# Altium project SAM_E54_Xplained_Pro.PrjPCB (part 1 of 4)
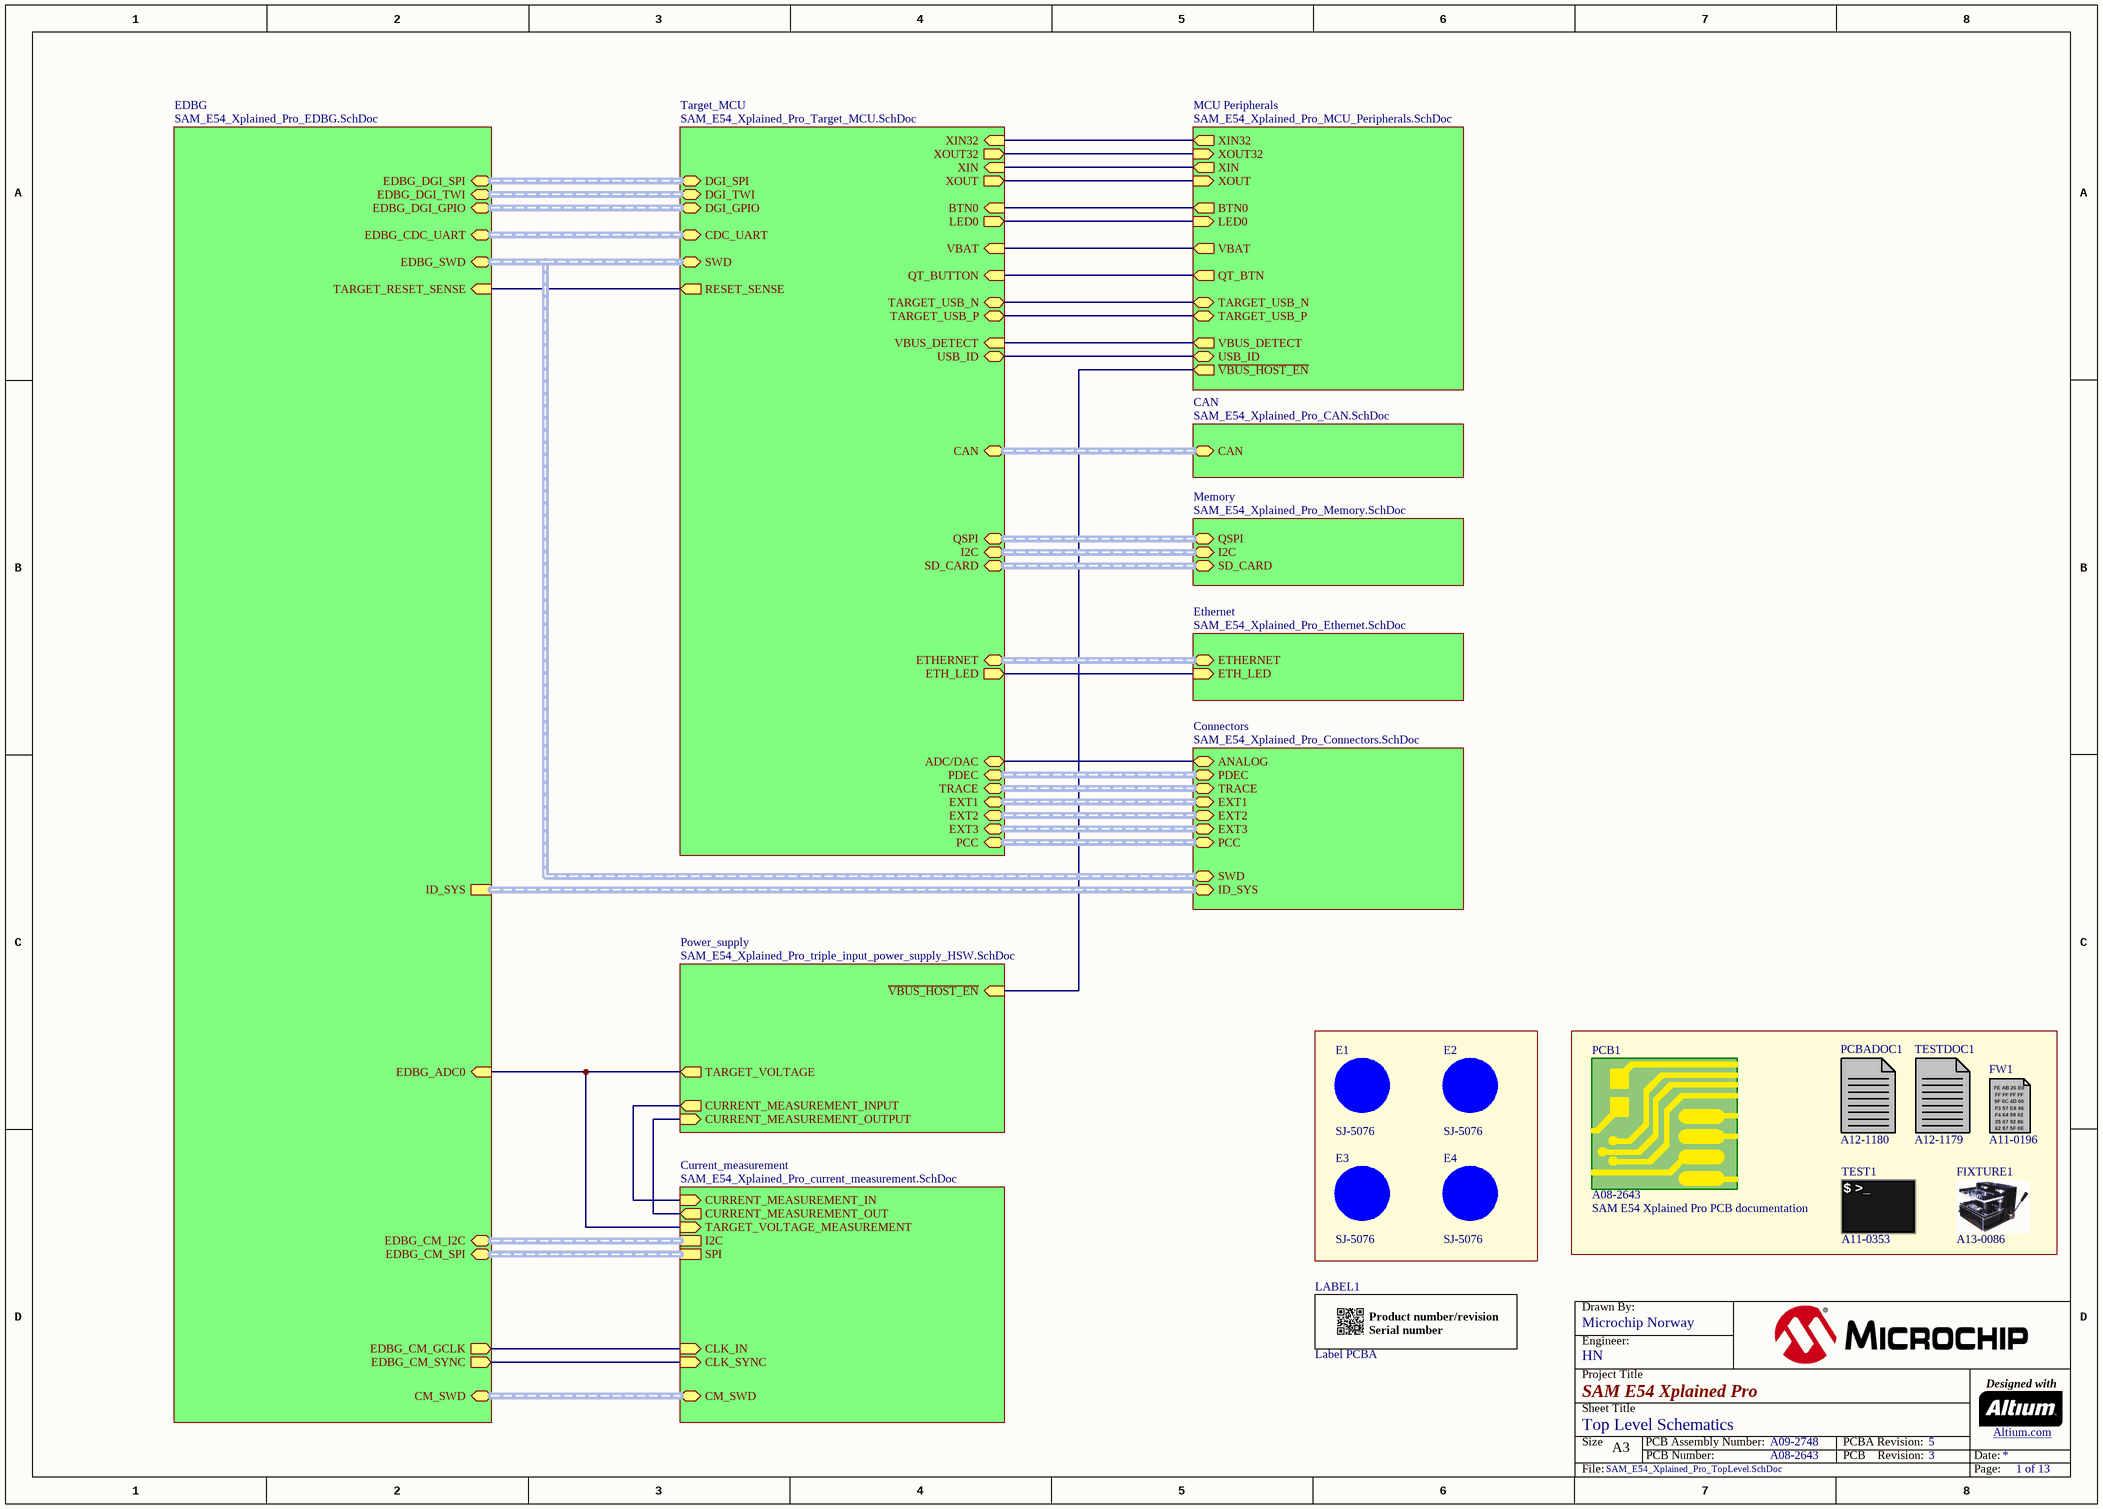
[diagram p0: SAM_E54_Xplained_Pro_TopLevel.SchDoc]
13 sheets, 307 parts. Net scope: hierarchical (ports join the sheet entries above them; power ports are global).
Board file: SAM_E54_Xplained_Pro.PcbDoc
Sheets:
  SAM_E54_Xplained_Pro_TopLevel.SchDoc
    Target_MCU = SAM_E54_Xplained_Pro_Target_MCU.SchDoc
    EDBG = SAM_E54_Xplained_Pro_EDBG.SchDoc
    Connectors = SAM_E54_Xplained_Pro_Connectors.SchDoc
    Power_supply = SAM_E54_Xplained_Pro_triple_input_power_supply_HSW.SchDoc
    Current_measurement = SAM_E54_Xplained_Pro_current_measurement.SchDoc
      Calibration = SAM_E54_Xplained_Pro_current_measurement_calibration.SchDoc
      Control = SAM_E54_Xplained_Pro_current_measurement_control.SchDoc
      Frontend = SAM_E54_Xplained_Pro_current_measurement_frontend.SchDoc
    Ethernet = SAM_E54_Xplained_Pro_Ethernet.SchDoc
    CAN = SAM_E54_Xplained_Pro_CAN.SchDoc
    Memory = SAM_E54_Xplained_Pro_Memory.SchDoc
    MCU Peripherals = SAM_E54_Xplained_Pro_MCU_Peripherals.SchDoc

## Sheet SAM_E54_Xplained_Pro_TopLevel.SchDoc: Top Level Schematics
size A3; Organization: Microchip Norway; Address1: Vestre Rosten 79; Address2: N-7075 TILLER; Address3: NORWAY; DocumentNumber: A09-2748; Revision: 5; SheetNumber: 1; SheetTotal: 13; DrawnBy: Microchip Norway; Engineer: HN; PageSetup: Record=PageOptions|CenterHorizontal=True|CenterVertical=True|PrintScale=1.01|XCorrection=1.00|YCorrection=1.00|PrintKind=1|BorderSize=5000000|LeftOffset=0|BottomOffset=0|Orientation=2|PaperLength=1000|PaperWidth=1000|Scale=100|PaperSource=7|PrintQuality=-4|MediaType=1|DitherType=10|PaperKind=Letter|PrintScaleMode=1; PCBNumber: A08-2643; PCBRevision: 3; ProjectTitle: SAM E54 Xplained Pro; ProjectName: SAM E54 Xplained Pro

### Parts
E1  value SJ-5076  [AP8-00192]
E2  value SJ-5076  [AP8-00192]
E3  value SJ-5076  [AP8-00192]
E4  value SJ-5076  [AP8-00192]
FIXTURE1  AN: A13-0086  (mechanical)
FW1  AN: A11-0196  (mechanical)
LABEL1  value Label PCBA  [AP8-00317]  (hidden comment: *)
PCB1  value SAM E54 Xplained Pro PCB documentation  AN: A08-2643  (mechanical)
PCBADOC1  AN: A12-1180  (mechanical)
TEST1  AN: A11-0353  (mechanical)
TESTDOC1  AN: A12-1179  (mechanical)

### Sub-sheets
CAN = SAM_E54_Xplained_Pro_CAN.SchDoc: CAN (harness CAN)
Connectors = SAM_E54_Xplained_Pro_Connectors.SchDoc: EXT1 (harness EXT), EXT3 (harness EXT), SWD (harness SWD), ID_SYS (harness ID_SYS), EXT2 (harness EXT), TRACE (harness TRACE), PCC (harness PCC), PDEC (harness PDEC), ANALOG (bidir)
Current_measurement = SAM_E54_Xplained_Pro_current_measurement.SchDoc: I2C (harness I2C), SPI (harness SPI), CLK_IN (in), CLK_SYNC (in), CURRENT_MEASUREMENT_OUT (out), CURRENT_MEASUREMENT_IN (in), TARGET_VOLTAGE_MEASUREMENT (in), CM_SWD (harness SWD)
EDBG = SAM_E54_Xplained_Pro_EDBG.SchDoc: ID_SYS (harness ID_SYS), EDBG_CDC_UART (harness UART), EDBG_DGI_TWI (harness I2C), EDBG_DGI_SPI (harness SPI), TARGET_RESET_SENSE (in), EDBG_ADC0 (in), EDBG_CM_I2C (harness I2C), EDBG_CM_SPI (harness SPI), EDBG_CM_GCLK (out), EDBG_CM_SYNC (out), CM_SWD (harness SWD), EDBG_SWD (harness SWD), EDBG_DGI_GPIO (harness GPIO)
Ethernet = SAM_E54_Xplained_Pro_Ethernet.SchDoc: ETHERNET (harness ETHERNET), ETH_LED (in)
MCU Peripherals = SAM_E54_Xplained_Pro_MCU_Peripherals.SchDoc: VBUS_DETECT (out), XIN32 (out), XIN (out), XOUT32 (in), TARGET_USB_N (bidir), TARGET_USB_P (bidir), BTN0 (out), LED0 (in), XOUT (in), ~{VBUS_HOST_EN} (out), VBAT (out), USB_ID (bidir), QT_BTN (out)
Memory = SAM_E54_Xplained_Pro_Memory.SchDoc: QSPI (harness QSPI), I2C (harness I2C), SD_CARD (harness SD_CARD)
Power_supply = SAM_E54_Xplained_Pro_triple_input_power_supply_HSW.SchDoc: TARGET_VOLTAGE (out), CURRENT_MEASUREMENT_INPUT (out), CURRENT_MEASUREMENT_OUTPUT (in), ~{VBUS_HOST_EN} (in)
Target_MCU = SAM_E54_Xplained_Pro_Target_MCU.SchDoc: DGI_SPI (harness SPI), DGI_TWI (harness I2C), CDC_UART (harness UART), EXT3 (harness EXT), EXT1 (harness EXT), RESET_SENSE (out), SWD (harness SWD), EXT2 (harness EXT), CAN (harness CAN), QSPI (harness QSPI), I2C (harness I2C), SD_CARD (harness SD_CARD), ETHERNET (harness ETHERNET), VBUS_DETECT (in), XIN32 (in), XIN (in), XOUT32 (out), TARGET_USB_N (bidir), TARGET_USB_P (bidir), BTN0 (in), LED0 (out), XOUT (out), USB_ID (bidir), VBAT (in), TRACE (harness TRACE), PCC (harness PCC), ETH_LED (out), DGI_GPIO (harness GPIO), QT_BUTTON (in), PDEC (harness PDEC), ADC/DAC (bidir)

### Nets
CM_PA09_AIN17: sheet EDBG/EDBG_ADC0, sheet Power_supply/TARGET_VOLTAGE, sheet Current_measurement/TARGET_VOLTAGE_MEASUREMENT
CM_PA11_GCLK5: sheet EDBG/EDBG_CM_SYNC, sheet Current_measurement/CLK_SYNC
CM_PA14_GCLK0: sheet EDBG/EDBG_CM_GCLK, sheet Current_measurement/CLK_IN
PA00_XIN32: sheet Target_MCU/XIN32, sheet MCU Peripherals/XIN32
PA01_XOUT32: sheet Target_MCU/XOUT32, sheet MCU Peripherals/XOUT32
PA02_ADC0_AIN0_DAC0: sheet Target_MCU/ADC/DAC, sheet Connectors/ANALOG
PA16_PCC_D00_PTCXY10: sheet Target_MCU/QT_BUTTON, sheet MCU Peripherals/QT_BTN
PB03_SUPER_CAP: sheet Target_MCU/VBAT, sheet MCU Peripherals/VBAT
PB22_XIN1: sheet Target_MCU/XIN, sheet MCU Peripherals/XIN
PB23_XOUT1: sheet Target_MCU/XOUT, sheet MCU Peripherals/XOUT
PB31_USER_BTN_DGI3: sheet Target_MCU/BTN0, sheet MCU Peripherals/BTN0
PC00_USB_VBUS: sheet Target_MCU/VBUS_DETECT, sheet MCU Peripherals/VBUS_DETECT
PC15_ETH_LED: sheet Target_MCU/ETH_LED, sheet Ethernet/ETH_LED
PC18_PDEC2_DGI2_LED: sheet Target_MCU/LED0, sheet MCU Peripherals/LED0
PC19_USB_ID: sheet Target_MCU/USB_ID, sheet MCU Peripherals/USB_ID
TARGET_RESETN: sheet Target_MCU/RESET_SENSE, sheet EDBG/TARGET_RESET_SENSE
TARGET_USB_N: sheet Target_MCU/TARGET_USB_N, sheet MCU Peripherals/TARGET_USB_N
TARGET_USB_P: sheet Target_MCU/TARGET_USB_P, sheet MCU Peripherals/TARGET_USB_P
VCC_CM_IN_P3V3: sheet Power_supply/CURRENT_MEASUREMENT_INPUT, sheet Current_measurement/CURRENT_MEASUREMENT_IN
NetJ100_3: sheet Power_supply/CURRENT_MEASUREMENT_OUTPUT, sheet Current_measurement/CURRENT_MEASUREMENT_OUT
NetJ303_4: sheet Power_supply/~{VBUS_HOST_EN}, sheet MCU Peripherals/~{VBUS_HOST_EN}

Not connected (* = marked no-connect by the designer): E1 1(FIDUCIAL); E2 1(FIDUCIAL); E3 1(FIDUCIAL); E4 1(FIDUCIAL)

### Buses and harness runs
harness sheet CAN/CAN = sheet Target_MCU/CAN
harness sheet Connectors/EXT1 = sheet Target_MCU/EXT1
harness sheet Connectors/EXT2 = sheet Target_MCU/EXT2
harness sheet Connectors/EXT3 = sheet Target_MCU/EXT3
harness sheet Connectors/ID_SYS = sheet EDBG/ID_SYS
harness sheet Connectors/PCC = sheet Target_MCU/PCC
harness sheet Connectors/PDEC = sheet Target_MCU/PDEC
harness sheet Connectors/SWD = sheet EDBG/EDBG_SWD = sheet Target_MCU/SWD
harness sheet Connectors/TRACE = sheet Target_MCU/TRACE
harness sheet Current_measurement/CM_SWD = sheet EDBG/CM_SWD
harness sheet Current_measurement/I2C = sheet EDBG/EDBG_CM_I2C
harness sheet Current_measurement/SPI = sheet EDBG/EDBG_CM_SPI
harness sheet EDBG/EDBG_CDC_UART = sheet Target_MCU/CDC_UART
harness sheet EDBG/EDBG_DGI_GPIO = sheet Target_MCU/DGI_GPIO
harness sheet EDBG/EDBG_DGI_SPI = sheet Target_MCU/DGI_SPI
harness sheet EDBG/EDBG_DGI_TWI = sheet Target_MCU/DGI_TWI
harness sheet Ethernet/ETHERNET = sheet Target_MCU/ETHERNET
harness sheet Memory/I2C = sheet Target_MCU/I2C
harness sheet Memory/QSPI = sheet Target_MCU/QSPI
harness sheet Memory/SD_CARD = sheet Target_MCU/SD_CARD

### Notes on the sheet
- Drawn By:
- Project Title
- Engineer:
- Designed with
- Sheet Title
- Size
- A3
- PCB Number:
- PCB Assembly Number:
- PCBA Revision:
- PCB    Revision:
- Date:
- Altium.com <http://go.altium.com/MicrochipLandingPage_Evaluation.html>
- File:
- Page:
- (in symbol A09-0611) / Product number/revision / Serial number
- (in symbol A11-0196) FE AB 26 E0; FF FF FF FF; 9F 0C 4D 00; F3 57 E8 96; F4 64 98 02; 35 07 92 86; 62 87 5F 0E
- (in symbol A11-0353) $ >_

### Library data of the parts
E1-E4 = A08-0053: 2.8mm adhesive feet,diam 8.0mm; PartGroup: Mechanical devices,Mounting accessories; Manufacturer: 3M; AN: A08-0053; Height: 2,79999995231628; MPN: SJ-5076
FIXTURE1 = A13-0086: Xplained PRO MCU board Jupiter Test Fixture; PartGroup: Test Equipment,Test Fixtures; Manufacturer: ESCATEC; Value: Xplained PRO MCU board Jupiter Test Fixture; MPN: Xplained PRO MCU board Jupiter Test Fixture
FW1 = A11-0196: EDBG secured firmware; PartGroup: Software,Firmware,Tools; Manufacturer: ATMEL; Value: EDBG secured firmware
LABEL1 = A09-0611: PCBA identification label PP Top White Gloss; PartGroup: Mechanical devices,Packaging materials,Printed Labels; Manufacturer: ACT Logimark AS; MPN: 505462; AN: A09-0611
PCB1 = A08-2643: SAM E54 Xplained Pro PCB documentation; PartGroup: Mechanical devices,Printed circuit boards
PCBADOC1 = A12-1180: SAM E54 Xplained Pro PCBA documentation; PartGroup: Documentation,PCBA Documents,Atmel; Value: SAM E54 Xplained Pro PCBA documentation
TEST1 = A11-0353: SAM E54 Xplained Pro eggTest; PartGroup: Software,Test software,Tools; Value: SAM E54 Xplained Pro eggTest
TESTDOC1 = A12-1179: SAM E54 Xplained Pro Test Instructions; PartGroup: Documentation,Procedures,Test Instructions; Value: SAM E54 Xplained Pro Test Instructions

## Sheet SAM_E54_Xplained_Pro_Target_MCU.SchDoc: Target MCU
size A3; Organization: Microchip Norway; Address1: Vestre Rosten 79; Address2: N-7075 TILLER; Address3: NORWAY; DocumentNumber: A09-2748; Revision: 5; SheetNumber: 3; SheetTotal: 13; DrawnBy: Microchip Norway; Engineer: HN; PageSetup: Record=PageOptions|CenterHorizontal=True|CenterVertical=True|PrintScale=1.01|XCorrection=1.00|YCorrection=1.00|PrintKind=1|BorderSize=5000000|LeftOffset=0|BottomOffset=0|Orientation=2|PaperLength=1000|PaperWidth=1000|Scale=100|PaperSource=7|PrintQuality=-4|MediaType=1|DitherType=10|PaperKind=A3 (297 x 420 mm)|PrintScaleMode=1; ProjectTitle: SAM E54 Xplained Pro; PCBNumber: A08-2643; PCBRevision: 3; ProjectName: SAM E54 Xplained Pro
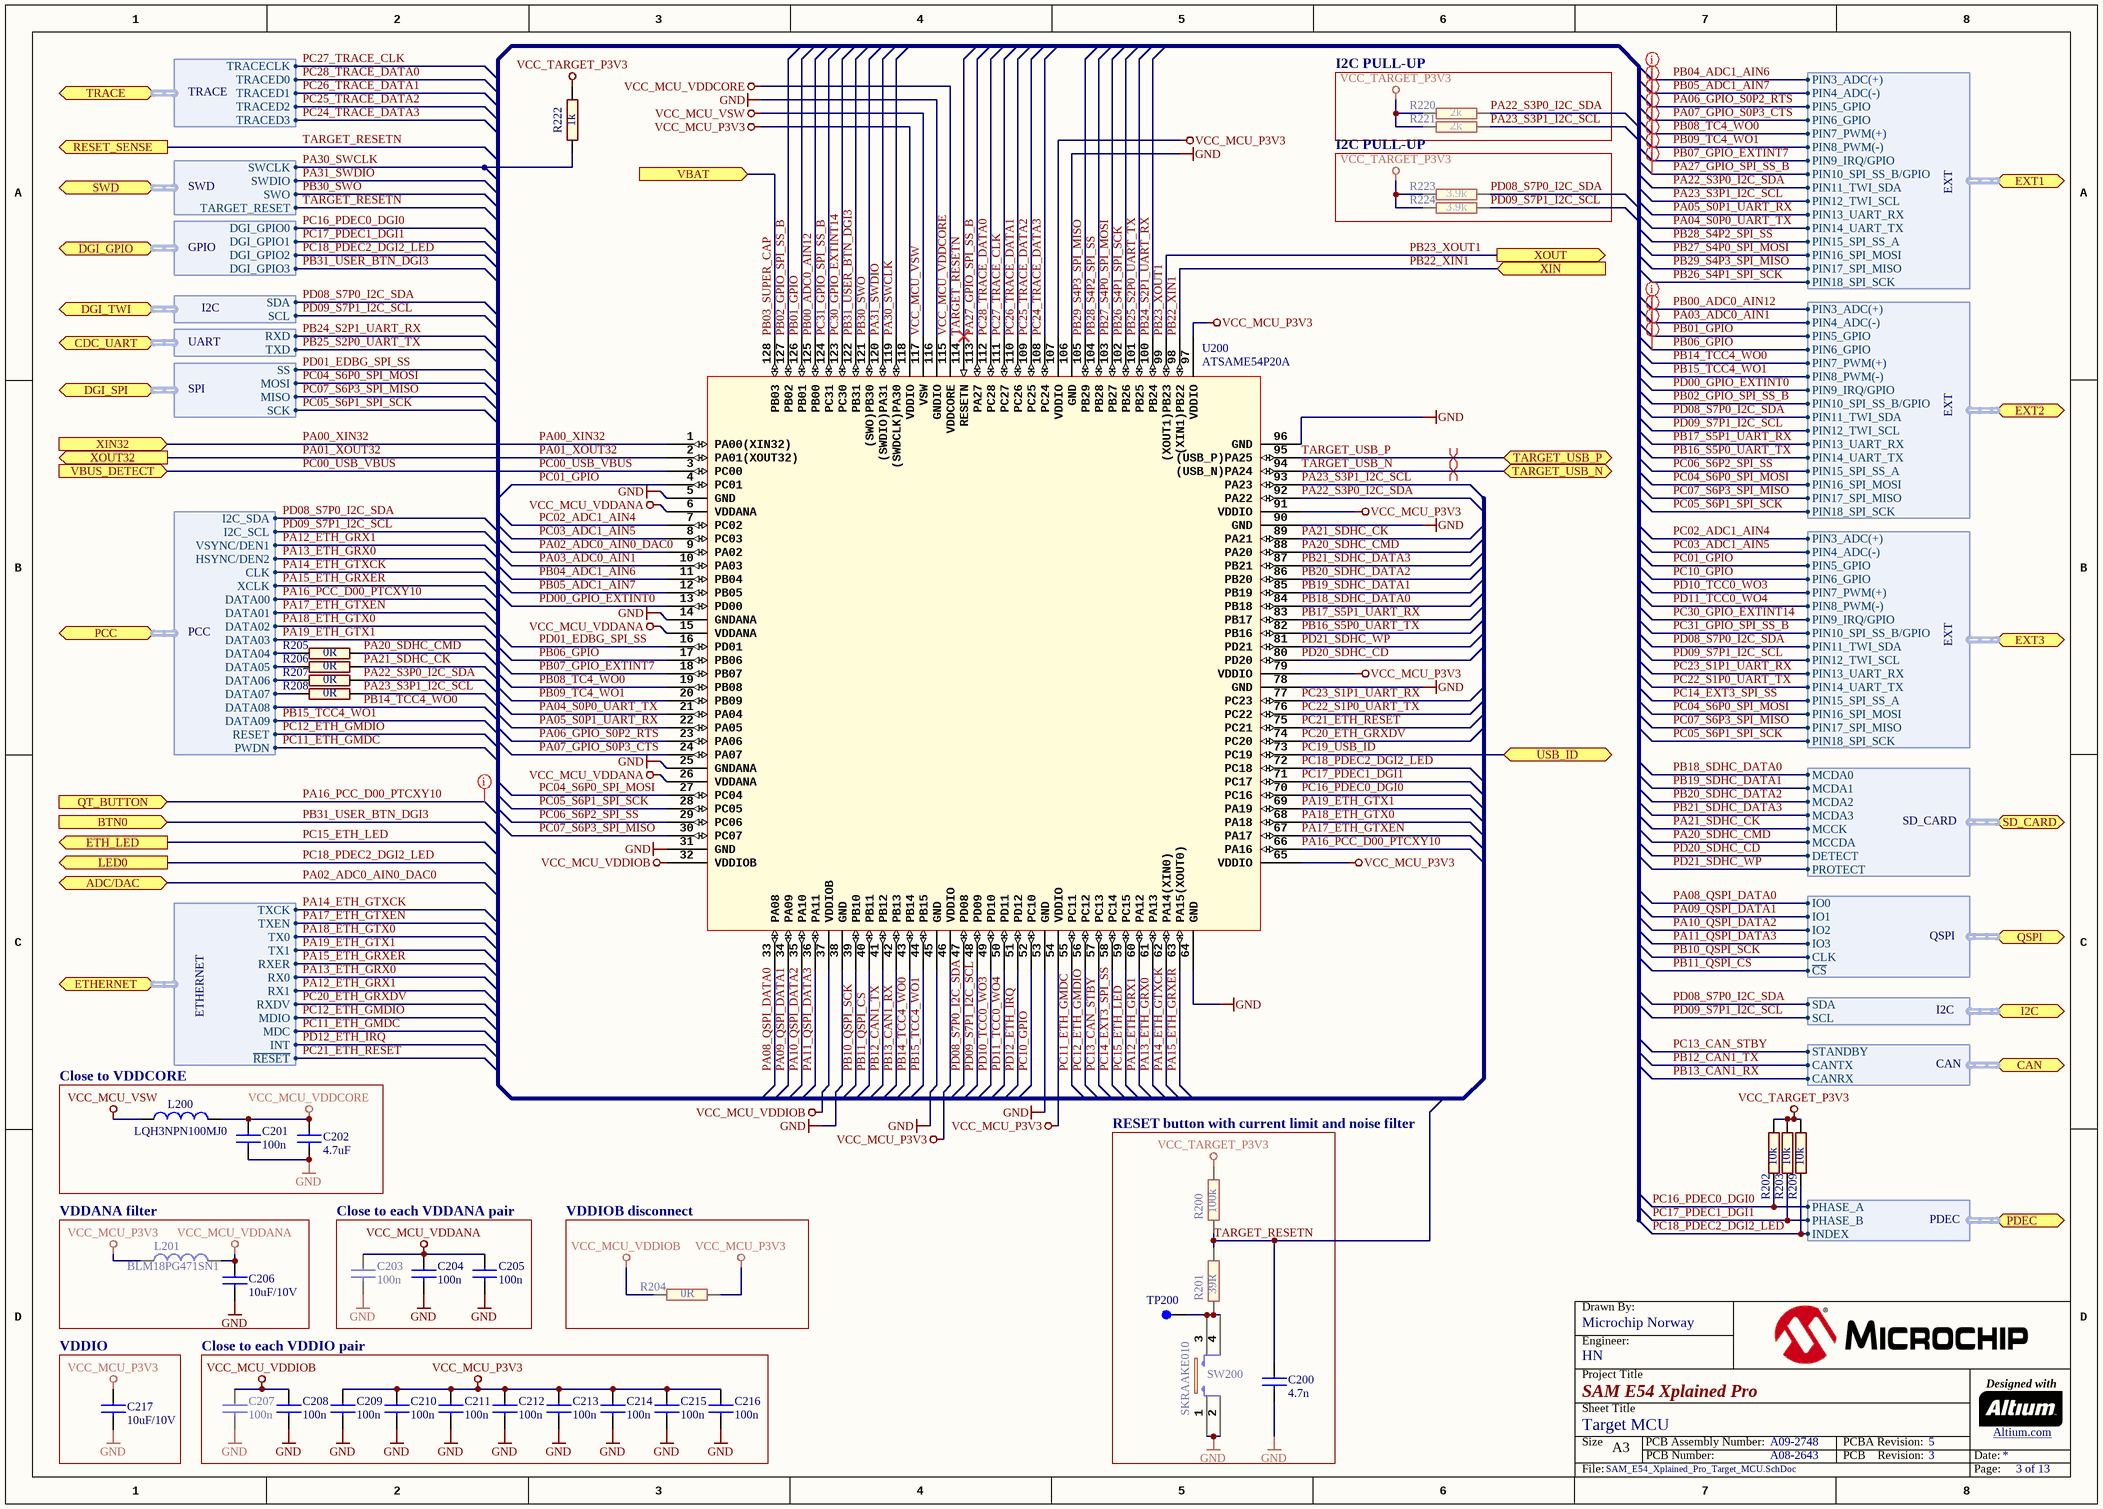
[diagram p1: SAM_E54_Xplained_Pro_Target_MCU.SchDoc]

### Parts
C200  value 4.7n  [AP1-00053]
C201  value 100n  [AP1-00053]
C202  value 4.7uF  [AP1-00117]
C203  value 100n  [AP1-00053]
C204  value 100n  [AP1-00053]
C205  value 100n  [AP1-00053]
C206  value 10uF/10V  [AP1-00117]
C207  value 100n  [AP1-00053]
C208  value 100n  [AP1-00053]
C209  value 100n  [AP1-00053]
C210  value 100n  [AP1-00053]
C211  value 100n  [AP1-00053]
C212  value 100n  [AP1-00053]
C213  value 100n  [AP1-00053]
C214  value 100n  [AP1-00053]
C215  value 100n  [AP1-00053]
C216  value 100n  [AP1-00053]
C217  value 10uF/10V  [AP1-00117]
L200  value LQH3NPN100MJ0  [AP3-00115]
L201  value BLM18PG471SN1  [AP3-00005]
R200  value 100k  [AP2-00011]
R201  value 39R  [AP2-00011]
R202  value 10k  [AP2-00011]
R203  value 10k  [AP2-00011]
R204  value 0R  [AP2-00000]
R205  value 0R  [AP2-00000]
R206  value 0R  [AP2-00000]
R207  value 0R  [AP2-00000]
R208  value 0R  [AP2-00000]
R209  value 10k  [AP2-00011]
R220  value 2k  [AP2-00011]
R221  value 2k  [AP2-00011]
R222  value 1k  [AP2-00011]
R223  value 3.9k  [AP2-00011]
R224  value 3.9k  [AP2-00011]
SW200  value SKRAAKE010  [AP8-00137]
TP200  (no value)  [AP8-00010]  (no BOM)
U200  value ATSAME54P20A  [AP6-00477]  (hidden comment: *)

### Blocks framed on the sheet
I2C PULL-UP: R220 R221
I2C PULL-UP: R223 R224
Close to VDDCORE: C201 C202 L200
RESET button with current limit and noise filter: C200 R200 R201 SW200 TP200
VDDANA filter: C206 L201
Close to each VDDANA pair: C203-C205
VDDIOB disconnect: R204
VDDIO: C217
Close to each VDDIO pair: C207-C216

### Ports
ADC/DAC (bidir), BTN0 (in), CAN (harness CAN), CDC_UART (harness UART), DGI_GPIO (harness GPIO), DGI_SPI (harness SPI), DGI_TWI (harness I2C), ETH_LED (out), ETHERNET (harness ETHERNET), EXT1 (harness EXT), EXT2 (harness EXT), EXT3 (harness EXT), I2C (harness I2C), LED0 (out), PCC (harness PCC), PDEC (harness PDEC), QSPI (harness QSPI), QT_BUTTON (in), RESET_SENSE (out), SD_CARD (harness SD_CARD), SWD (harness SWD), TARGET_USB_N (bidir), TARGET_USB_P (bidir), TRACE (harness TRACE), USB_ID (bidir), VBAT (in), VBUS_DETECT (in), XIN32 (in), XIN (in), XOUT32 (out), XOUT (out)

### Harnesses
GPIO: DGI_GPIO0, DGI_GPIO1, DGI_GPIO2, DGI_GPIO3
SPI: MISO, MOSI, SCK, SS
I2C: SCL, SDA
UART: RXD, TXD
EXT: PIN10_SPI_SS_B/GPIO, PIN11_TWI_SDA, PIN12_TWI_SCL, PIN13_UART_RX, PIN14_UART_TX, PIN15_SPI_SS_A, PIN16_SPI_MOSI, PIN17_SPI_MISO, PIN18_SPI_SCK, PIN3_ADC(+), PIN4_ADC(-), PIN5_GPIO, PIN6_GPIO, PIN7_PWM(+), PIN8_PWM(-), PIN9_IRQ/GPIO
I2C: SDA, SCL
SD_CARD: MCCDA, MCCK, MCDA3, MCDA2, MCDA1, MCDA0, DETECT, PROTECT
QSPI: CLK, IO3, IO2, IO0, IO1, ~{CS}
ETHERNET: TX0, TX1, TXEN, TXCK, RX0, RX1, MDC, MDIO, RXER, RXDV, INT, ~{RESET}
CAN: CANTX, CANRX, STANDBY
TRACE: TRACECLK, TRACED0, TRACED1, TRACED2, TRACED3
SWD: SWCLK, SWDIO, TARGET_RESET, SWO
PCC: VSYNC/DEN1, HSYNC/DEN2, I2C_SCL, I2C_SDA, XCLK, DATA00, CLK, DATA01, DATA02, DATA03, DATA04, DATA05, DATA06, DATA07, DATA08, DATA09, RESET, PWDN
PDEC: INDEX, PHASE_A, PHASE_B

### Nets
GND: C200.2 C201.2 C202.2 C203.2 C204.2 C205.2 C206.2 C207.2 C208.2 C209.2 C210.2 C211.2 C212.2 C213.2 C214.2 C215.2 C216.2 C217.2 SW200.1 SW200.2 U200.5(GND) U200.14(GNDANA) U200.25(GNDANA) U200.31(GND) U200.38(GND) U200.45(GND) U200.53(GND) U200.64(GND) U200.78(GND) U200.90(GND) U200.96(GND) U200.106(GND) U200.116(GNDIO)
VCC_MCU_P3V3: C209.1 C210.1 C211.1 C212.1 C213.1 C214.1 C215.1 C216.1 C217.1 L201.1 R204.1 U200.46(VDDIO) U200.54(VDDIO) U200.65(VDDIO) U200.79(VDDIO) U200.91(VDDIO) U200.97(VDDIO) U200.107(VDDIO) U200.118(VDDIO)
VCC_MCU_VDDANA: C203.1 C204.1 C205.1 C206.1 L201.2 U200.6(VDDANA) U200.15(VDDANA) U200.26(VDDANA)
VCC_MCU_VDDCORE: C201.1 C202.1 L200.2 U200.115(VDDCORE)
VCC_MCU_VDDIOB: C207.1 C208.1 R204.2 U200.32(VDDIOB) U200.37(VDDIOB)
VCC_MCU_VSW: L200.1 U200.117(VSW)
VCC_TARGET_P3V3: R200.2 R202.2 R203.1 R209.1 R220.2 R221.2 R222.2 R223.2 R224.2
PA00_XIN32: U200.1(PA00(XIN32)) ; port XIN32
PA01_XOUT32: U200.2(PA01(XOUT32)) ; port XOUT32
PA02_ADC0_AIN0_DAC0: U200.9(PA02) ; port ADC/DAC
PA03_ADC0_AIN1: U200.10(PA03) ; port EXT2.PIN4_ADC(-)
PA04_S0P0_UART_TX: U200.21(PA04) ; port EXT1.PIN14_UART_TX
PA05_S0P1_UART_RX: U200.22(PA05) ; port EXT1.PIN13_UART_RX
PA06_GPIO_S0P2_RTS: U200.23(PA06) ; port EXT1.PIN5_GPIO
PA07_GPIO_S0P3_CTS: U200.24(PA07) ; port EXT1.PIN6_GPIO
PA08_QSPI_DATA0: U200.33(PA08) ; port QSPI.IO0
PA09_QSPI_DATA1: U200.34(PA09) ; port QSPI.IO1
PA10_QSPI_DATA2: U200.35(PA10) ; port QSPI.IO2
PA11_QSPI_DATA3: U200.36(PA11) ; port QSPI.IO3
PA12_ETH_GRX1: U200.60(PA12) ; port ETHERNET.RX1, port PCC.VSYNC/DEN1
PA13_ETH_GRX0: U200.61(PA13) ; port ETHERNET.RX0, port PCC.HSYNC/DEN2
PA14_ETH_GTXCK: U200.62(PA14(XIN0)) ; port ETHERNET.TXCK, port PCC.CLK
PA15_ETH_GRXER: U200.63(PA15(XOUT0)) ; port ETHERNET.RXER, port PCC.XCLK
PA16_PCC_D00_PTCXY10: U200.66(PA16) ; port QT_BUTTON, port PCC.DATA00
PA17_ETH_GTXEN: U200.67(PA17) ; port ETHERNET.TXEN, port PCC.DATA01
PA18_ETH_GTX0: U200.68(PA18) ; port ETHERNET.TX0, port PCC.DATA02
PA19_ETH_GTX1: U200.69(PA19) ; port ETHERNET.TX1, port PCC.DATA03
PA20_SDHC_CMD: R205.1 U200.88(PA20) ; port SD_CARD.MCCDA
PA21_SDHC_CK: R206.1 U200.89(PA21) ; port SD_CARD.MCCK
PA22_S3P0_I2C_SDA: R207.1 R220.1 U200.92(PA22) ; port EXT1.PIN11_TWI_SDA
PA23_S3P1_I2C_SCL: R208.1 R221.1 U200.93(PA23) ; port EXT1.PIN12_TWI_SCL
PA27_GPIO_SPI_SS_B: U200.113(PA27) ; port EXT1.PIN10_SPI_SS_B/GPIO
PA30_SWCLK: R222.1 U200.119((SWDCLK)PA30) ; port SWD.SWCLK
PA31_SWDIO: U200.120((SWDIO)PA31) ; port SWD.SWDIO
PB00_ADC0_AIN12: U200.125(PB00) ; port EXT2.PIN3_ADC(+)
PB01_GPIO: U200.126(PB01) ; port EXT2.PIN5_GPIO
PB02_GPIO_SPI_SS_B: U200.127(PB02) ; port EXT2.PIN10_SPI_SS_B/GPIO
PB03_SUPER_CAP: U200.128(PB03) ; port VBAT
PB04_ADC1_AIN6: U200.11(PB04) ; port EXT1.PIN3_ADC(+)
PB05_ADC1_AIN7: U200.12(PB05) ; port EXT1.PIN4_ADC(-)
PB06_GPIO: U200.17(PB06) ; port EXT2.PIN6_GPIO
PB07_GPIO_EXTINT7: U200.18(PB07) ; port EXT1.PIN9_IRQ/GPIO
PB08_TC4_WO0: U200.19(PB08) ; port EXT1.PIN7_PWM(+)
PB09_TC4_WO1: U200.20(PB09) ; port EXT1.PIN8_PWM(-)
PB10_QSPI_SCK: U200.39(PB10) ; port QSPI.CLK
PB11_QSPI_CS: U200.40(PB11) ; port QSPI.~{CS}
PB12_CAN1_TX: U200.41(PB12) ; port CAN.CANTX
PB13_CAN1_RX: U200.42(PB13) ; port CAN.CANRX
PB14_TCC4_WO0: U200.43(PB14) ; port EXT2.PIN7_PWM(+), port PCC.DATA08
PB15_TCC4_WO1: U200.44(PB15) ; port EXT2.PIN8_PWM(-), port PCC.DATA09
PB16_S5P0_UART_TX: U200.82(PB16) ; port EXT2.PIN14_UART_TX
PB17_S5P1_UART_RX: U200.83(PB17) ; port EXT2.PIN13_UART_RX
PB18_SDHC_DATA0: U200.84(PB18) ; port SD_CARD.MCDA0
PB19_SDHC_DATA1: U200.85(PB19) ; port SD_CARD.MCDA1
PB20_SDHC_DATA2: U200.86(PB20) ; port SD_CARD.MCDA2
PB21_SDHC_DATA3: U200.87(PB21) ; port SD_CARD.MCDA3
PB22_XIN1: U200.98((XIN1)PB22) ; port XIN
PB23_XOUT1: U200.99((XOUT1)PB23) ; port XOUT
PB24_S2P1_UART_RX: U200.100(PB24) ; port CDC_UART.RXD
PB25_S2P0_UART_TX: U200.101(PB25) ; port CDC_UART.TXD
PB26_S4P1_SPI_SCK: U200.102(PB26) ; port EXT1.PIN18_SPI_SCK
PB27_S4P0_SPI_MOSI: U200.103(PB27) ; port EXT1.PIN16_SPI_MOSI
PB28_S4P2_SPI_SS: U200.104(PB28) ; port EXT1.PIN15_SPI_SS_A
PB29_S4P3_SPI_MISO: U200.105(PB29) ; port EXT1.PIN17_SPI_MISO
PB30_SWO: U200.121((SWO)PB30) ; port SWD.SWO
PB31_USER_BTN_DGI3: U200.122(PB31) ; port BTN0, port DGI_GPIO.DGI_GPIO3
PC00_USB_VBUS: U200.3(PC00) ; port VBUS_DETECT
PC01_GPIO: U200.4(PC01) ; port EXT3.PIN5_GPIO
PC02_ADC1_AIN4: U200.7(PC02) ; port EXT3.PIN3_ADC(+)
PC03_ADC1_AIN5: U200.8(PC03) ; port EXT3.PIN4_ADC(-)
PC04_S6P0_SPI_MOSI: U200.27(PC04) ; port DGI_SPI.MOSI, port EXT3.PIN16_SPI_MOSI, port EXT2.PIN16_SPI_MOSI
PC05_S6P1_SPI_SCK: U200.28(PC05) ; port DGI_SPI.SCK, port EXT3.PIN18_SPI_SCK, port EXT2.PIN18_SPI_SCK
PC06_S6P2_SPI_SS: U200.29(PC06) ; port EXT2.PIN15_SPI_SS_A
PC07_S6P3_SPI_MISO: U200.30(PC07) ; port DGI_SPI.MISO, port EXT3.PIN17_SPI_MISO, port EXT2.PIN17_SPI_MISO
PC10_GPIO: U200.52(PC10) ; port EXT3.PIN6_GPIO
PC11_ETH_GMDC: U200.55(PC11) ; port ETHERNET.MDC, port PCC.PWDN
PC12_ETH_GMDIO: U200.56(PC12) ; port ETHERNET.MDIO, port PCC.RESET
PC13_CAN_STBY: U200.57(PC13) ; port CAN.STANDBY
PC14_EXT3_SPI_SS: U200.58(PC14) ; port EXT3.PIN15_SPI_SS_A
PC15_ETH_LED: U200.59(PC15) ; port ETH_LED
PC16_PDEC0_DGI0: R202.1 U200.70(PC16) ; port DGI_GPIO.DGI_GPIO0, port PDEC.PHASE_A
PC17_PDEC1_DGI1: R203.2 U200.71(PC17) ; port DGI_GPIO.DGI_GPIO1, port PDEC.PHASE_B
PC18_PDEC2_DGI2_LED: R209.2 U200.72(PC18) ; port LED0, port DGI_GPIO.DGI_GPIO2, port PDEC.INDEX
PC19_USB_ID: U200.73(PC19) ; port USB_ID
PC20_ETH_GRXDV: U200.74(PC20) ; port ETHERNET.RXDV
PC21_ETH_RESET: U200.75(PC21) ; port ETHERNET.~{RESET}
PC22_S1P0_UART_TX: U200.76(PC22) ; port EXT3.PIN14_UART_TX
PC23_S1P1_UART_RX: U200.77(PC23) ; port EXT3.PIN13_UART_RX
PC24_TRACE_DATA3: U200.108(PC24) ; port TRACE.TRACED3
PC25_TRACE_DATA2: U200.109(PC25) ; port TRACE.TRACED2
PC26_TRACE_DATA1: U200.110(PC26) ; port TRACE.TRACED1
PC27_TRACE_CLK: U200.111(PC27) ; port TRACE.TRACECLK
PC28_TRACE_DATA0: U200.112(PC28) ; port TRACE.TRACED0
PC30_GPIO_EXTINT14: U200.123(PC30) ; port EXT3.PIN9_IRQ/GPIO
PC31_GPIO_SPI_SS_B: U200.124(PC31) ; port EXT3.PIN10_SPI_SS_B/GPIO
PD00_GPIO_EXTINT0: U200.13(PD00) ; port EXT2.PIN9_IRQ/GPIO
PD01_EDBG_SPI_SS: U200.16(PD01) ; port DGI_SPI.SS
PD08_S7P0_I2C_SDA: R223.1 U200.47(PD08) ; port DGI_TWI.SDA, port EXT3.PIN11_TWI_SDA, port EXT2.PIN11_TWI_SDA, port I2C.SDA, port PCC.I2C_SDA
PD09_S7P1_I2C_SCL: R224.1 U200.48(PD09) ; port DGI_TWI.SCL, port EXT3.PIN12_TWI_SCL, port EXT2.PIN12_TWI_SCL, port I2C.SCL, port PCC.I2C_SCL
PD10_TCC0_WO3: U200.49(PD10) ; port EXT3.PIN7_PWM(+)
PD11_TCC0_WO4: U200.50(PD11) ; port EXT3.PIN8_PWM(-)
PD12_ETH_IRQ: U200.51(PD12) ; port ETHERNET.INT
PD20_SDHC_CD: U200.80(PD20) ; port SD_CARD.DETECT
PD21_SDHC_WP: U200.81(PD21) ; port SD_CARD.PROTECT
TARGET_RESETN: C200.1 R200.1 R201.2 U200.114(RESETN) ; port RESET_SENSE, port SWD.TARGET_RESET
TARGET_USB_N: U200.94((USB_N)PA24) ; port TARGET_USB_N
TARGET_USB_P: U200.95((USB_P)PA25) ; port TARGET_USB_P
NetJ406_9: R208.2 ; port PCC.DATA07
NetJ406_10: R207.2 ; port PCC.DATA06
NetJ406_11: R206.2 ; port PCC.DATA05
NetJ406_12: R205.2 ; port PCC.DATA04
NetR201_1: R201.1 SW200.3 SW200.4 TP200.1

### Layout directives
differential pair: TARGET_USB_N, TARGET_USB_P
net class QTouch: PA03_ADC0_AIN1, PA06_GPIO_S0P2_RTS, PA07_GPIO_S0P3_CTS, PA16_PCC_D00_PTCXY10, PA27_GPIO_SPI_SS_B, PB00_ADC0_AIN12, PB01_GPIO, PB04_ADC1_AIN6, PB05_ADC1_AIN7, PB06_GPIO, PB07_GPIO_EXTINT7, PB08_TC4_WO0, PB09_TC4_WO1

### Notes on the sheet
- Drawn By:
- Project Title
- Engineer:
- Designed with
- Sheet Title
- Size
- A3
- PCB Number:
- PCB Assembly Number:
- PCBA Revision:
- PCB    Revision:
- Date:
- Altium.com <http://go.altium.com/MicrochipLandingPage_Evaluation.html>
- File:
- Page:

### Library data of the parts
C200 = A01-0046: Ceramic capacitor, SMD 0402, X7R, 25V, +/-10% (de35287); PartGroup: Capacitors,Ceramic,SMD 0402; Manufacturer: PHYCOMP; MPN: 2238 587 15632; TemperatureRange: -55 - +125 deg C; AN: A01-0046; Tolerance: 25V, +/-10%; Height: 0,550000011920929
C201 C203-C205 C207-C216 = A01-0246: Ceramic capacitor, SMD 0402, X7R, 16V, +/-10%; PartGroup: Capacitors,Ceramic,SMD 0402; Manufacturer: Kemet; MPN: C0402C104K4RACTU; TemperatureRange: -55 - +125 deg C; AN: A01-0246; Tolerance: 16V, +/-10%; Height: 0,5
C202 = A01-0377: Ceramic capacitor, SMD 0603, X5R, 10V, 10% (de31036); PartGroup: Capacitors,Ceramic,SMD 0603; Manufacturer: WALSIN Technology Corporation; MPN: 0603X475K100CT; TemperatureRange: -55 - +85 deg C; AN: A01-0377; Tolerance: 10%; Height: 0,800000011920929
C206 C217 = A01-0461: Ceramic capacitor, SMD 0603, X5R, 10V, 10UF Â± 20%; PartGroup: Capacitors,Ceramic,SMD 0603; Manufacturer: AVX; MPN: 0603ZD106MAT2A; Tolerance: Â± 20%; TemperatureRange: -55Â°C to +85Â°C; AN: A01-0461
L200 = A03-0191: 10uH power inductor, Isat = 560mA , Itemp = 710mA, Rdc = 0.360ohm; PartGroup: Inductors,Power Inductors; Manufacturer: Murata; Tolerance: Â±20%; TemperatureRange: -40 - 85Â°C; AN: A03-0191; Height: 1,10000002384186; MPN: LQH3NPN100MJ0
L201 = A03-0035: SMD RF inductor 0603. Z=470Ohm (@100MHz), Max R(dc)=0.65Ohm, Max current=1A; PartGroup: Inductors,EMI; Manufacturer: Murata; TemperatureRange: -55; AN: A03-0035; Height: 0,800000011920929; MPN: BLM18PG471SN1
R200 = A02-0260: Thick film resistor, SMD 0402, 1/16W, 1%; PartGroup: Resistors,SMD,0402 1%; Manufacturer: ASJ; MPN: CR10-1003-FK; TemperatureRange: -55ï¿½ to +125ï¿½C; AN: A02-0260; Tolerance: 1 %; Height: 0,349999994039536
R201 = A02-0178: Thick film resistor, SMD 0402, 1/16W, 1%; PartGroup: Resistors,SMD,0402 1%; Manufacturer: ASJ; MPN: CR10-39R0-FK; TemperatureRange: -55 - +125 deg C; AN: A02-0178; Tolerance: 1 %; Height: 0,349999994039536
R202 R203 R209 = A02-0236: Thick film resistor, SMD 0402, 1/16W, 1%; PartGroup: Resistors,SMD,0402 1%; Manufacturer: vishay; MPN: CRCW040210K0FKED; TemperatureRange: -55 - +125 deg C; AN: A02-0236; Tolerance: 1 %; Height: 0,349999994039536
R204-R208 = A02-0163: RES 0.0 OHM 1/16W 0402 SMD; PartGroup: Resistors,SMD,0402 1%; Manufacturer: (n/a); MPN: RMCF0402ZT0R00; Tolerance: 1 %; TemperatureRange: -55 - +125 deg C; AN: A02-0163; Height: 0,349999994039536
R220 R221 = A02-0219: Thick film resistor, SMD 0402, 1/16W, 1%; PartGroup: Resistors,SMD,0402 1%; TemperatureRange: -55 - +125 deg C; AN: A02-0219; Tolerance: 1 %; Height: 0,349999994039536
R222 = A02-0212: Thick film resistor, SMD 0402, 1/16W, 1%; PartGroup: Resistors,SMD,0402 1%; Manufacturer: ASJ; MPN: CR10-1001-FK; TemperatureRange: -55 - +125 deg C; AN: A02-0212; Tolerance: 1 %; Height: 0,349999994039536
R223 R224 = A02-0226: Thick film resistor, SMD 0402, 1/16W, 1%; PartGroup: Resistors,SMD,0402 1%; TemperatureRange: -55 - +125 deg C; AN: A02-0226; Tolerance: 1 %; Height: 0,349999994039536
SW200 = A08-0790: 6.2x6.2 mm SMD tact switch, same as A08-0091 but less force is needed; PartGroup: Mechanical devices,Switches,SMD; Manufacturer: ALPS; TemperatureRange: -30 - +90 deg C; AN: A08-0790; Height: 5,09999990463257; MPN: SKRAAKE010
TP200 = A08-0004: Single SMD testpad; PartGroup: Mechanical devices,Connectors,Test points; AN: A08-0004; Value: TESTPAD; Height: 0
U200 = A06-1528: Atmel 32-bit RISC MCU; PartGroup: Integrated Circuits,MCU, MPU, DSP,ARM MCU; MPN: ATSAME54P20A-AUT; TemperatureRange: -40Â°C +85Â°C; AN: A06-1528; Height: 1,20000004768372; Manufacturer: ATMEL

## Sheet SAM_E54_Xplained_Pro_EDBG.SchDoc: Embedded Debugger (EDBG)
size A3; Organization: Microchip Norway; Address1: Vestre Rosten 79; Address2: N-7075 TILLER; Address3: NORWAY; DocumentNumber: A09-2748; Revision: 5; SheetNumber: 9; SheetTotal: 13; DrawnBy: Microchip Norway; Engineer: HN; PageSetup: Record=PageOptions|CenterHorizontal=True|CenterVertical=True|PrintScale=0.73|XCorrection=1.00|YCorrection=1.00|PrintKind=1|BorderSize=5000000|LeftOffset=0|BottomOffset=0|Orientation=2|PaperLength=1000|PaperWidth=1000|Scale=100|PaperSource=7|PrintQuality=-4|MediaType=1|DitherType=10|PaperKind=A3 (297 x 420 mm)|PrintScaleMode=1; ProjectTitle: SAM E54 Xplained Pro; PCBNumber: A08-2643; PCBRevision: 3; ProjectName: SAM E54 Xplained Pro
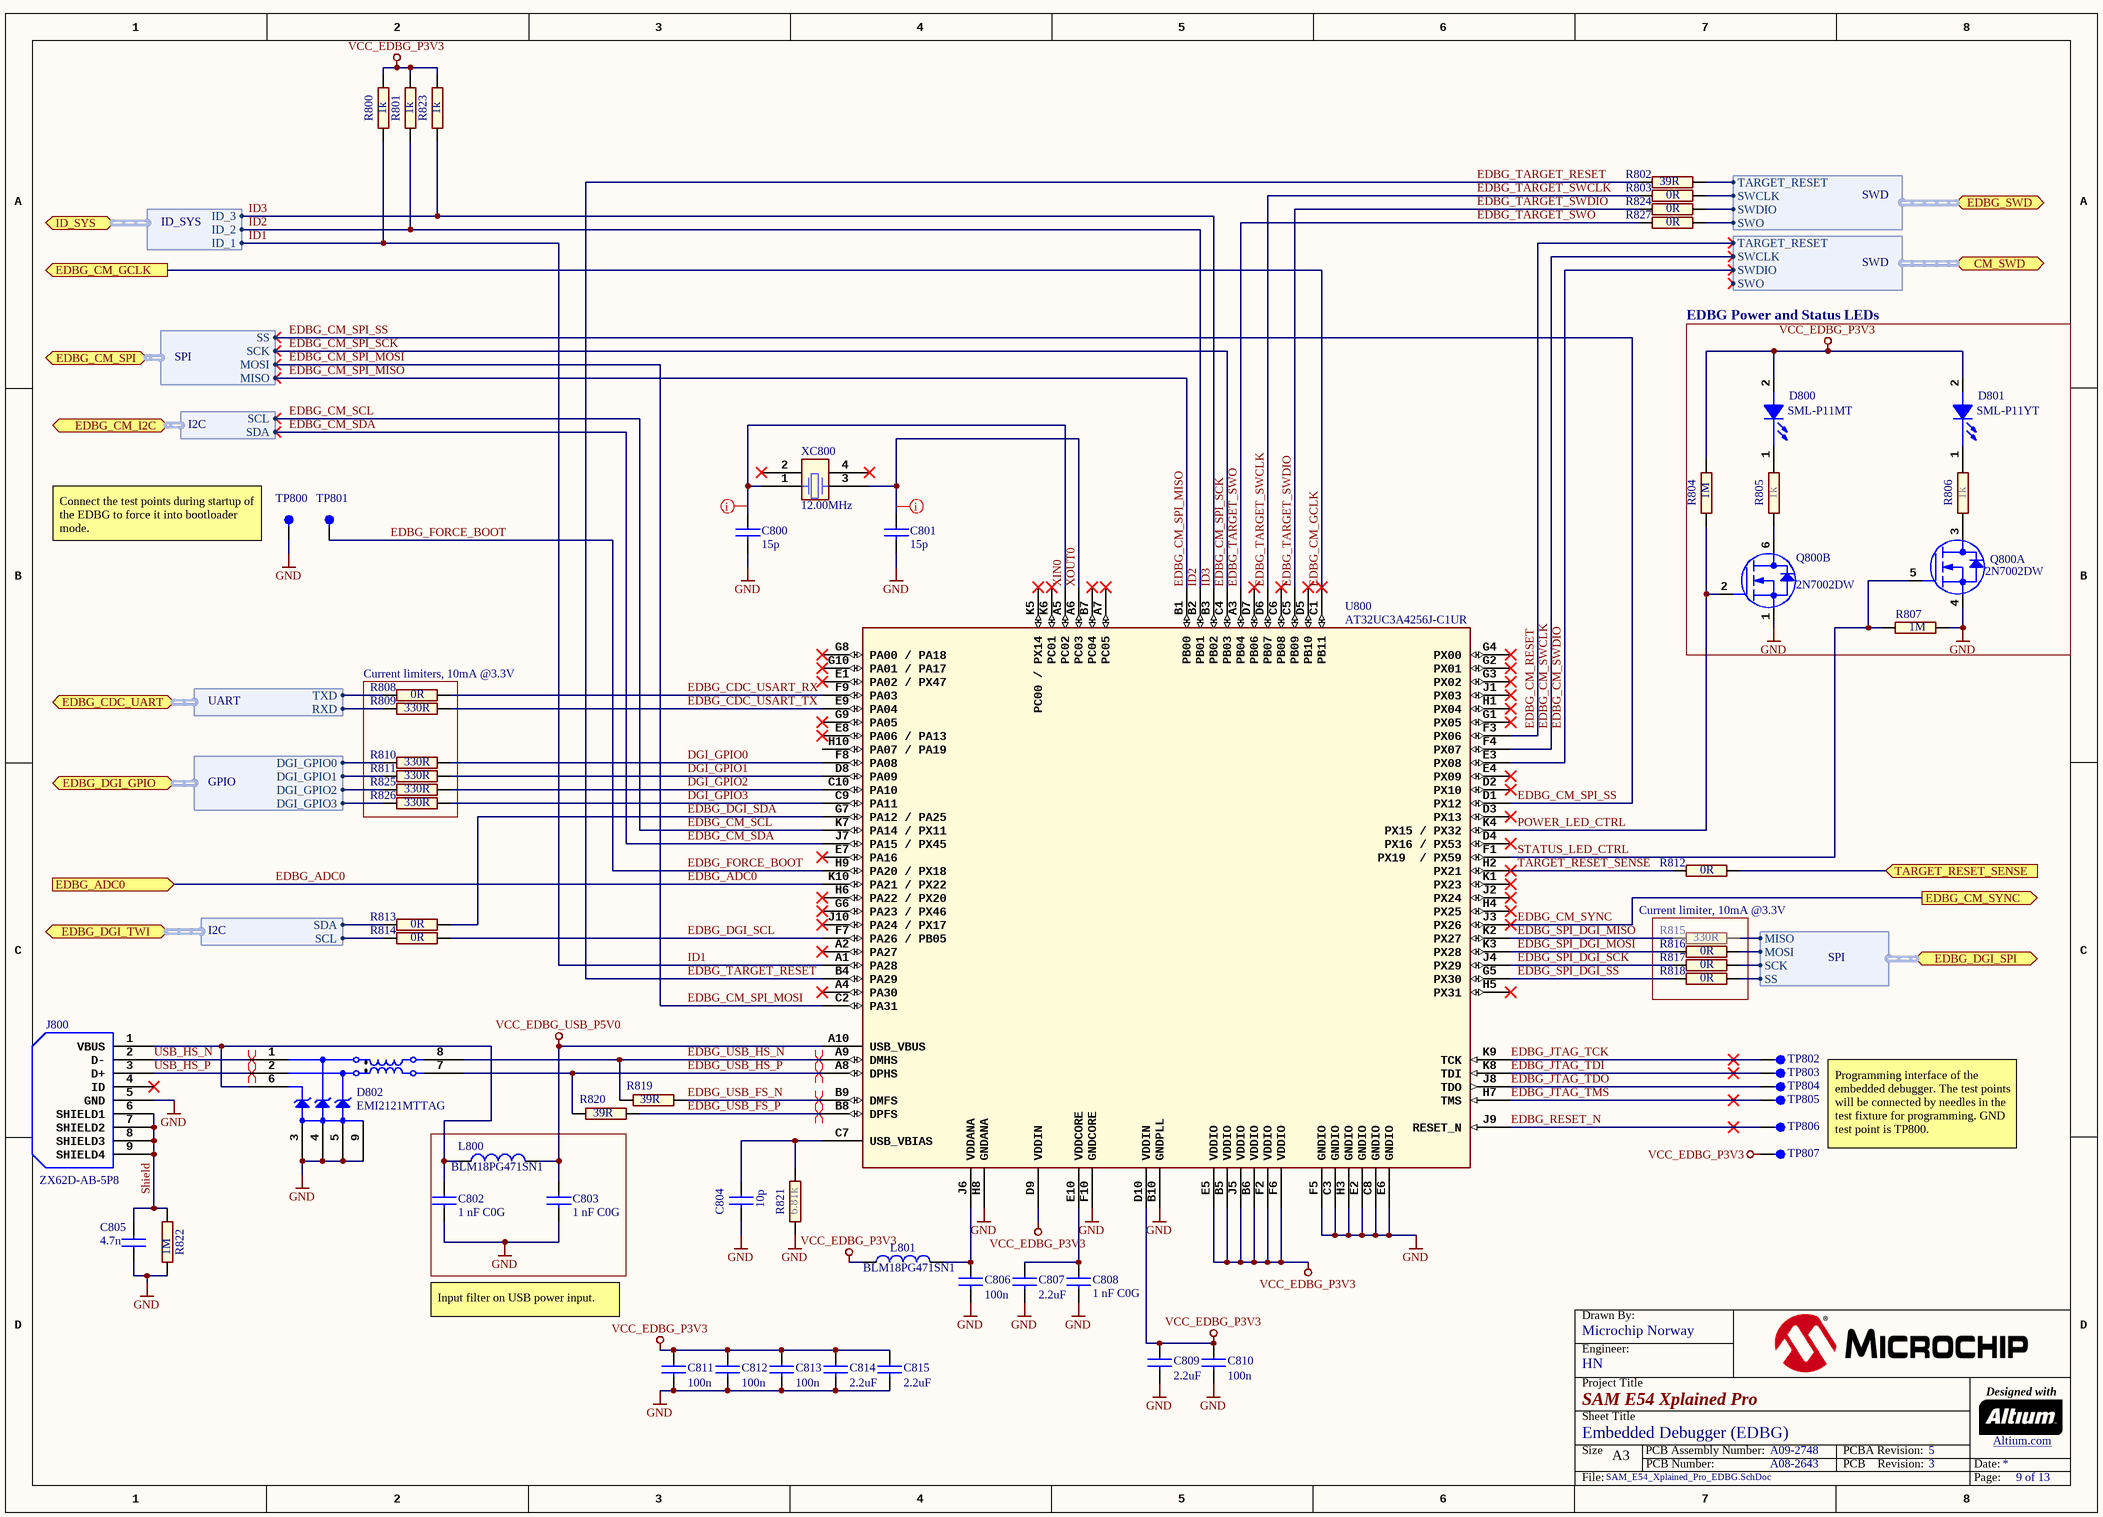
[diagram p2: SAM_E54_Xplained_Pro_EDBG.SchDoc]

### Parts
C800  value 15p  [AP1-00053]
C801  value 15p  [AP1-00053]
C802  value 1 nF C0G  [AP1-00053]
C803  value 1 nF C0G  [AP1-00053]
C804  value 10p  [AP1-00053]
C805  value 4.7n  [AP1-00053]
C806  value 100n  [AP1-00053]
C807  value 2.2uF  [AP1-00053]  (hidden comment: Farnell no: 1288200)
C808  value 1 nF C0G  [AP1-00053]
C809  value 2.2uF  [AP1-00053]  (hidden comment: Farnell no: 1288200)
C810  value 100n  [AP1-00053]
C811  value 100n  [AP1-00053]
C812  value 100n  [AP1-00053]
C813  value 100n  [AP1-00053]
C814  value 2.2uF  [AP1-00053]  (hidden comment: Farnell no: 1288200)
C815  value 2.2uF  [AP1-00053]  (hidden comment: Farnell no: 1288200)
D800  value SML-P11MT  [AP4-00160]
D801  value SML-P11YT  [AP4-00160]
D802  value EMI2121MTTAG  [AP4-00159]
J800  value ZX62D-AB-5P8  [AP8-00852]
L800  value BLM18PG471SN1  [AP3-00005]
L801  value BLM18PG471SN1  [AP3-00005]
Q800  value 2N7002DW  [AP5-00001]  (parts A,B of 2)
R800  value 1k  [AP2-00000]
R801  value 1k  [AP2-00000]
R802  value 39R  [AP2-00000]
R803  value 0R  [AP2-00000]
R804  value 1M  [AP2-00011]
R805  value 1k  [AP2-00011]
R806  value 1k  [AP2-00011]
R807  value 1M  [AP2-00011]
R808  value 0R  [AP2-00000]
R809  value 330R  [AP2-00000]
R810  value 330R  [AP2-00000]
R811  value 330R  [AP2-00000]
R812  value 0R  [AP2-00000]
R813  value 0R  [AP2-00000]
R814  value 0R  [AP2-00000]
R815  value 330R  [AP2-00000]
R816  value 0R  [AP2-00000]
R817  value 0R  [AP2-00000]
R818  value 0R  [AP2-00000]
R819  value 39R  [AP2-00011]
R820  value 39R  [AP2-00011]
R821  value 6.81k  [AP2-00011]
R822  value 1M  [AP2-00011]
R823  value 1k  [AP2-00000]
R824  value 0R  [AP2-00000]
R825  value 330R  [AP2-00000]
R826  value 330R  [AP2-00000]
R827  value 0R  [AP2-00000]
TP800  (no value)  [AP8-00010]  (no BOM)
TP801  (no value)  [AP8-00010]  (no BOM)
TP802  (no value)  [AP8-00010]  (no BOM)
TP803  (no value)  [AP8-00010]  (no BOM)
TP804  (no value)  [AP8-00010]  (no BOM)
TP805  (no value)  [AP8-00010]  (no BOM)
TP806  (no value)  [AP8-00010]  (no BOM)
TP807  (no value)  [AP8-00010]  (no BOM)
U800  value AT32UC3A4256J-C1UR  [AP6-00206]
XC800  value 12.00MHz  [AP7-00089]

### Blocks framed on the sheet
EDBG Power and Status LEDs: D800 D801 Q800 R804-R807
Current limiters, 10mA @3.3V: R808-R811 R825 R826

### Ports
CM_SWD (harness SWD), EDBG_ADC0 (in), EDBG_CDC_UART (harness UART), EDBG_CM_GCLK (out), EDBG_CM_I2C (harness I2C), EDBG_CM_SPI (harness SPI), EDBG_CM_SYNC (out), EDBG_DGI_GPIO (harness GPIO), EDBG_DGI_SPI (harness SPI), EDBG_DGI_TWI (harness I2C), EDBG_SWD (harness SWD), ID_SYS (harness ID_SYS), TARGET_RESET_SENSE (in)

### Harnesses
UART: TXD, RXD
SPI: MISO, MOSI, SCK, SS
ID_SYS: ID_1, ID_3, ID_2
I2C: SCL, SDA
SWD: SWCLK, SWDIO, TARGET_RESET, SWO
GPIO: DGI_GPIO0, DGI_GPIO1, DGI_GPIO2, DGI_GPIO3

### Nets
GND: C800.2 C801.2 C802.2 C803.2 C804.2 C805.1 C806.2 C807.2 C808.2 C809.2 C810.2 C811.2 C812.2 C813.2 C814.2 C815.2 D802.3(GND) D802.4(GND) D802.5(GND) D802.9(GND) J800.5(GND) Q800.1(S2) Q800.4(S1) R807.1 R821.1 R822.1 TP800.1 U800.B10(GNDPLL) U800.C3(GNDIO) U800.C8(GNDIO) U800.E2(GNDIO) U800.E6(GNDIO) U800.F5(GNDIO) U800.F10(GNDCORE) U800.H3(GNDIO) U800.H8(GNDANA)
VCC_EDBG_P3V3: C809.1 C810.1 C811.1 C812.1 C813.1 C814.1 C815.1 D800.2(ANODE) D801.2(ANODE) L801.1 R800.2 R801.2 R804.2 R823.2 TP807.1 U800.B5(VDDIO) U800.B6(VDDIO) U800.D9(VDDIN) U800.D10(VDDIN) U800.E5(VDDIO) U800.F2(VDDIO) U800.F6(VDDIO) U800.J5(VDDIO)
VCC_EDBG_USB_P5V0: C803.1 L800.2 U800.A10(USB_VBUS)
DGI_GPIO0: R810.2 U800.F8(PA08)
DGI_GPIO1: R811.2 U800.D8(PA09)
DGI_GPIO2: R825.2 U800.C10(PA10)
DGI_GPIO3: R826.2 U800.C9(PA11)
EDBG_ADC0: U800.K10(PA21_/_PX22) ; port EDBG_ADC0  [project net CM_PA09_AIN17]
EDBG_CDC_USART_RX: R808.1 U800.F9(PA03)
EDBG_CDC_USART_TX: R809.2 U800.E9(PA04)
EDBG_CM_GCLK: U800.C1(PB11) ; port EDBG_CM_GCLK  [project net CM_PA14_GCLK0]
EDBG_CM_RESET: U800.F3(PX06) ; port CM_SWD.TARGET_RESET  [project net CM_RESET_N]
EDBG_CM_SCL: U800.K7(PA14_/_PX11) ; port EDBG_CM_I2C.SCL  [project net CM_PA17_SERCOM1_SCL]
EDBG_CM_SDA: U800.J7(PA15_/_PX45) ; port EDBG_CM_I2C.SDA  [project net CM_PA16_SERCOM1_SDA]
EDBG_CM_SPI_MISO: U800.B1(PB00) ; port EDBG_CM_SPI.MISO  [project net CM_PA24_SERCOM3_PAD2_SPI_MISO]
EDBG_CM_SPI_MOSI: U800.C2(PA31) ; port EDBG_CM_SPI.MOSI  [project net CM_PA22_SERCOM3_PAD0_SPI_MOSI]
EDBG_CM_SPI_SCK: U800.C4(PB03) ; port EDBG_CM_SPI.SCK  [project net CM_PA23_SERCOM3_PAD1_SPI_SCK]
EDBG_CM_SPI_SS: U800.D1(PX12) ; port EDBG_CM_SPI.SS  [project net CM_PA25_SPI_SS]
EDBG_CM_SWCLK: U800.F4(PX07) ; port CM_SWD.SWCLK  [project net CM_PA30_SWCLK]
EDBG_CM_SWDIO: U800.E3(PX08) ; port CM_SWD.SWDIO  [project net CM_PA31_SWDIO]
EDBG_CM_SYNC: U800.J3(PX26) ; port EDBG_CM_SYNC  [project net CM_PA11_GCLK5]
EDBG_DGI_SCL: R814.1 U800.F7(PA26_/_PB05)
EDBG_DGI_SDA: R813.1 U800.G7(PA12_/_PA25)
EDBG_FORCE_BOOT: TP801.1 U800.H9(PA20_/_PX18)
EDBG_JTAG_TCK: TP802.1 U800.K9(TCK)
EDBG_JTAG_TDI: TP803.1 U800.K8(TDI)
EDBG_JTAG_TDO: TP804.1 U800.J8(TDO)
EDBG_JTAG_TMS: TP805.1 U800.H7(TMS)
EDBG_RESET_N: TP806.1 U800.J9(RESET_N)
EDBG_SPI_DGI_MISO: R815.1 U800.K2(PX27)
EDBG_SPI_DGI_MOSI: R816.2 U800.K3(PX28)
EDBG_SPI_DGI_SCK: R817.2 U800.J4(PX29)
EDBG_SPI_DGI_SS: R818.2 U800.G5(PX30)
EDBG_TARGET_RESET: R802.1 U800.B4(PA29)
EDBG_TARGET_SWCLK: R803.2 U800.D6(PB07)
EDBG_TARGET_SWDIO: R824.2 U800.C5(PB09)
EDBG_TARGET_SWO: R827.2 U800.A3(PB04)
EDBG_USB_FS_N: R819.2 U800.B9(DMFS)
EDBG_USB_FS_P: R820.2 U800.B8(DPFS)
EDBG_USB_HS_N: D802.8(DIFF1_INT) R819.1 U800.A9(DMHS)
EDBG_USB_HS_P: D802.7(DIFF2_INT) R820.1 U800.A8(DPHS)
ID1: R800.1 U800.A1(PA28) ; port ID_SYS.ID_1
ID2: R801.1 U800.B2(PB01) ; port ID_SYS.ID_2
ID3: R823.1 U800.B3(PB02) ; port ID_SYS.ID_3
PA30_SWCLK: R803.1 ; port EDBG_SWD.SWCLK
PA31_SWDIO: R824.1 ; port EDBG_SWD.SWDIO
PB24_S2P1_UART_RX: R809.1 ; port EDBG_CDC_UART.RXD
PB25_S2P0_UART_TX: R808.2 ; port EDBG_CDC_UART.TXD
PB30_SWO: R827.1 ; port EDBG_SWD.SWO
PB31_USER_BTN_DGI3: R826.1 ; port EDBG_DGI_GPIO.DGI_GPIO3
PC04_S6P0_SPI_MOSI: R816.1 ; port EDBG_DGI_SPI.MOSI
PC05_S6P1_SPI_SCK: R817.1 ; port EDBG_DGI_SPI.SCK
PC07_S6P3_SPI_MISO: R815.2 ; port EDBG_DGI_SPI.MISO
PC16_PDEC0_DGI0: R810.1 ; port EDBG_DGI_GPIO.DGI_GPIO0
PC17_PDEC1_DGI1: R811.1 ; port EDBG_DGI_GPIO.DGI_GPIO1
PC18_PDEC2_DGI2_LED: R825.1 ; port EDBG_DGI_GPIO.DGI_GPIO2
PD01_EDBG_SPI_SS: R818.1 ; port EDBG_DGI_SPI.SS
PD08_S7P0_I2C_SDA: R813.2 ; port EDBG_DGI_TWI.SDA
PD09_S7P1_I2C_SCL: R814.2 ; port EDBG_DGI_TWI.SCL
POWER_LED_CTRL: Q800.2(G2) R804.1 U800.K4(PX15_/_PX32)
Shield: C805.2 J800.6(SHIELD1) J800.7(SHIELD2) J800.8(SHIELD3) J800.9(SHIELD4) R822.2
STATUS_LED_CTRL: Q800.5(G1) R807.2 U800.F1(PX19__/_PX59)
TARGET_RESET_SENSE: R812.2 U800.H2(PX21)
TARGET_RESETN: R802.2 R812.1 ; port TARGET_RESET_SENSE, port EDBG_SWD.TARGET_RESET
USB_HS_N: D802.1(DIFF1_EXT) J800.2(D-)
USB_HS_P: D802.2(DIFF2_EXT) J800.3(D+)
XIN0: C800.1 U800.A5(PC02) XC800.1
XOUT0: C801.1 U800.A6(PC03) XC800.3
NetC802_1: C802.1 D802.6(VBUS) J800.1(VBUS) L800.1
NetC804_1: C804.1 R821.2 U800.C7(USB_VBIAS)
NetC806_1: C806.1 L801.2 U800.J6(VDDANA)
NetC807_1: C807.1 C808.1 U800.E10(VDDCORE)
NetD800_1: D800.1(CATHODE) R805.2
NetD801_1: D801.1(CATHODE) R806.2
NetQ800_3: Q800.3(D1) R806.1
NetQ800_6: Q800.6(D2) R805.1

Not connected (* = marked no-connect by the designer): J800 4(ID)*; U800 A2(PA27)* A4(PA30)* A7(PC05)* B7(PC04)* C6(PB08)* D2(PX10)* D3(PX13)* D4(PX16_/_PX53)* D5(PB10)* D7(PB06)* E1(PA02_/_PX47)* E4(PX09)* E7(PA16)* E8(PA06_/_PA13)* G1(PX05)* G2(PX01)* G3(PX02)* G4(PX00)* G6(PA23_/_PX46)* G8(PA00_/_PA18)* G9(PA05)* G10(PA01_/_PA17)* H1(PX04)* H4(PX25)* H5(PX31)* H6(PA22_/_PX20)* H10(PA07_/_PA19) J1(PX03)* J2(PX24)* J10(PA24_/_PX17)* K1(PX23)* K5(PC00_/_PX14)* K6(PC01)*; XC800 2* 4*

### Layout directives
differential pair; rule Assembly Testpoint Usage [Testpoint - Not Allowed    Multiple - Not Allowed]: EDBG_USB_FS_N, EDBG_USB_FS_P, EDBG_USB_HS_N, EDBG_USB_HS_P, USB_HS_N, USB_HS_P
rule Assembly Testpoint Usage [Testpoint - Not Allowed    Multiple - Not Allowed]: XIN0, XOUT0

### Notes on the sheet
- (near TP800) Connect the test points during startup of the EDBG to force it into bootloader mode.
- Current limiter, 10mA @3.3V
- Programming interface of the embedded debugger. The test points will be connected by needles in the test fixture for programming. GND test point is TP800.
- Input filter on USB power input.
- Drawn By:
- Project Title
- Engineer:
- Designed with
- Sheet Title
- Size
- A3
- PCB Number:
- PCB Assembly Number:
- PCBA Revision:
- PCB    Revision:
- Date:
- Altium.com <http://go.altium.com/MicrochipLandingPage_Evaluation.html>
- File:
- Page:

### Library data of the parts
C800 C801 = A01-0017: Ceramic capacitor, SMD 0402, NP0, 50V, +/-5%; PartGroup: Capacitors,Ceramic,SMD 0402; Manufacturer: AVX; MPN: 04025A150JAT2A; TemperatureRange: -55 - +125 deg C; AN: A01-0017; Height: 0,550000011920929; Tolerance: 50V, +/-5%
C802 C803 C808 = A01-0321: Ceramic capacitor, SMD 0402, C0G, 50V, +/-5%; PartGroup: Capacitors,Ceramic,SMD 0402; Manufacturer: Murata; MPN: GRM1555C1H102JA01D; Tolerance: 5%; AN: A01-0321; Height: 0,550000011920929
C804 = A01-0015: Ceramic capacitor, SMD 0402, NP0, 50V, +/-5%; PartGroup: Capacitors,Ceramic,SMD 0402; Manufacturer: AVX; MPN: 04025A100JAT2A; TemperatureRange: -55 - +125 deg C; AN: A01-0015; Tolerance: 50V, +/-5%; Height: 0,550000011920929
C805 = A01-0046: Ceramic capacitor, SMD 0402, X7R, 25V, +/-10%; PartGroup: Capacitors,Ceramic,SMD 0402; Manufacturer: PHYCOMP; MPN: 2238 587 15632; TemperatureRange: -55 - +125 deg C; AN: A01-0046; Tolerance: 25V, +/-10%; Height: 0,550000011920929
C806 C810-C813 = A01-0246: as C201 on sheet SAM_E54_Xplained_Pro_Target_MCU; AN: A01-0246; Tolerance: 16V, +/-10%; Height: 0,5
C807 C809 C814 C815 = A01-0300: Ceramic capacitor, SMD 0402, X5R, 6.3V, +/-20%; PartGroup: Capacitors,Ceramic,SMD 0402; Manufacturer: Kemet; MPN: C0402C225M9PAC; Tolerance: Â±20%; TemperatureRange: -55Â°C to +85Â°C; AN: A01-0300; Height: 0,5
D800 = A10-0183: LED, SMD 0402, Green, Wave length=569nm, 2.1mcd @ (1mA, 1.9Vf); PartGroup: Opto,LEDs,SMD; Manufacturer: ROHM; MPN: SML-P11MT-T86; TemperatureRange: -40 to +85; AN: A10-0183; Height: 0,200000002980232
D801 = A10-0182: LED, SMD 0402, Yellow, Wave length=586nm, 7.6mcd @ (1mA, 1.9Vf); PartGroup: Opto,LEDs,SMD; Manufacturer: ROHM; MPN: SML-P11YT-T86; TemperatureRange: -40 to +85; AN: A10-0182; Height: 0,200000002980232
D802 = A04-0195: EMI2121, SZEMI2121 Single Pair Common Mode Filter with ESD Protection; PartGroup: Diodes,Transient suppression; Manufacturer: ON Semiconductor; TemperatureRange: âˆ’40 to +85 Â°C; AN: A04-0195; Height: 0,800000011920929; MPN: EMI2121MTTAG
J800 = A08-2112: Micro USB AB Connector, Standard SMT + DIP; PartGroup: Mechanical devices,Connectors,USB; Manufacturer: HIROSE; MPN: ZX62D-AB-5P8(30); AN: A08-2112; Height: 2,79999995231628
L800 L801 = A03-0035: as L201 on sheet SAM_E54_Xplained_Pro_Target_MCU; AN: A03-0035; Height: 0,800000011920929; MPN: BLM18PG471SN1
Q800 = A05-0051: Dual N-Channel MOSFET, 60V, 115mA cont,RDS(ON) < 7.5 Ohm @50mA@5V, SOT-363; PartGroup: Transistors,Small signal FET,SMD; Manufacturer: Fairchild; TemperatureRange: -65 to 150 deg C; AN: A05-0051; Height: 1,10000002384186; MPN: 2N7002DW
R800 R801 R805 R806 R823 = A02-0212: as R222 on sheet SAM_E54_Xplained_Pro_Target_MCU; AN: A02-0212; Tolerance: 1 %; Height: 0,349999994039536
R802 R819 R820 = A02-0178: as R201 on sheet SAM_E54_Xplained_Pro_Target_MCU; AN: A02-0178; Tolerance: 1 %; Height: 0,349999994039536
R803 R808 R812-R814 R816-R818 R824 R827 = A02-0163: as R204 on sheet SAM_E54_Xplained_Pro_Target_MCU; AN: A02-0163; Height: 0,349999994039536
R804 R807 R822 = A02-0284: Thick film resistor, SMD 0402, 1/16W, 1%; PartGroup: Resistors,SMD,0402 1%; Manufacturer: ASJ; MPN: CR10-1004-FK; TemperatureRange: -55 - +125 deg C; AN: A02-0284; Tolerance: 1 %; Height: 0,349999994039536
R809-R811 R815 R825 R826 = A02-0200: Thick film resistor, SMD 0402, 1/16W, 1%; PartGroup: Resistors,SMD,0402 1%; Manufacturer: ASJ; MPN: CR10-3300-FK; TemperatureRange: -55 - +125 deg C; AN: A02-0200; Tolerance: 1 %; Height: 0,349999994039536
R821 = A02-0539: Thick film resistor, SMD 0402, 1/16W, 1%; PartGroup: Resistors,SMD,0402 1%; Manufacturer: vishay; MPN: CRCW04026K81FKED; TemperatureRange: -55 - +125 deg C; AN: A02-0539; Tolerance: 1%; Height: 0,349999994039536
TP800-TP807 = A08-0004: as TP200 on sheet SAM_E54_Xplained_Pro_Target_MCU; AN: A08-0004; Value: TESTPAD; Height: 0
U800 = A06-0736: AVR 32-bit RISC MCU; PartGroup: Integrated Circuits,MCU, MPU, DSP,AVR MCU; Manufacturer: ATMEL; TemperatureRange: -40 to +85 deg C; AN: A06-0736; Height: 1; MPN: AT32UC3A4256J-C1UR
XC800 = A07-0128: Kyocera CX3225GB12000H0KPSC1, 12MHz, 12pF, SMD crystal; PartGroup: Frequency devices,Crystals,SMD; Manufacturer: Kyocera Crystal Device Corporation; Tolerance: Â±30ppm; TemperatureRange: -40Â°C to +85Â°C; AN: A07-0128; Height: 0,800000011920929; MPN: CX3225GB12000H0KPSC1

## Sheet SAM_E54_Xplained_Pro_Connectors.SchDoc: Extension connectors
size A3; Organization: Microchip Norway; Address1: Vestre Rosten 79; Address2: N-7075 TILLER; Address3: NORWAY; DocumentNumber: A09-2748; Revision: 5; SheetNumber: 5; SheetTotal: 13; DrawnBy: Microchip Norway; Engineer: HN; PageSetup: Record=PageOptions|CenterHorizontal=True|CenterVertical=True|PrintScale=1.01|XCorrection=1.00|YCorrection=1.00|PrintKind=1|BorderSize=5000000|LeftOffset=0|BottomOffset=0|Orientation=2|PaperLength=1000|PaperWidth=1000|Scale=100|PaperSource=7|PrintQuality=-4|MediaType=1|DitherType=10|PaperKind=A3 (297 x 420 mm)|PrintScaleMode=1; ProjectTitle: SAM E54 Xplained Pro; PCBNumber: A08-2643; PCBRevision: 3; ProjectName: SAM E54 Xplained Pro
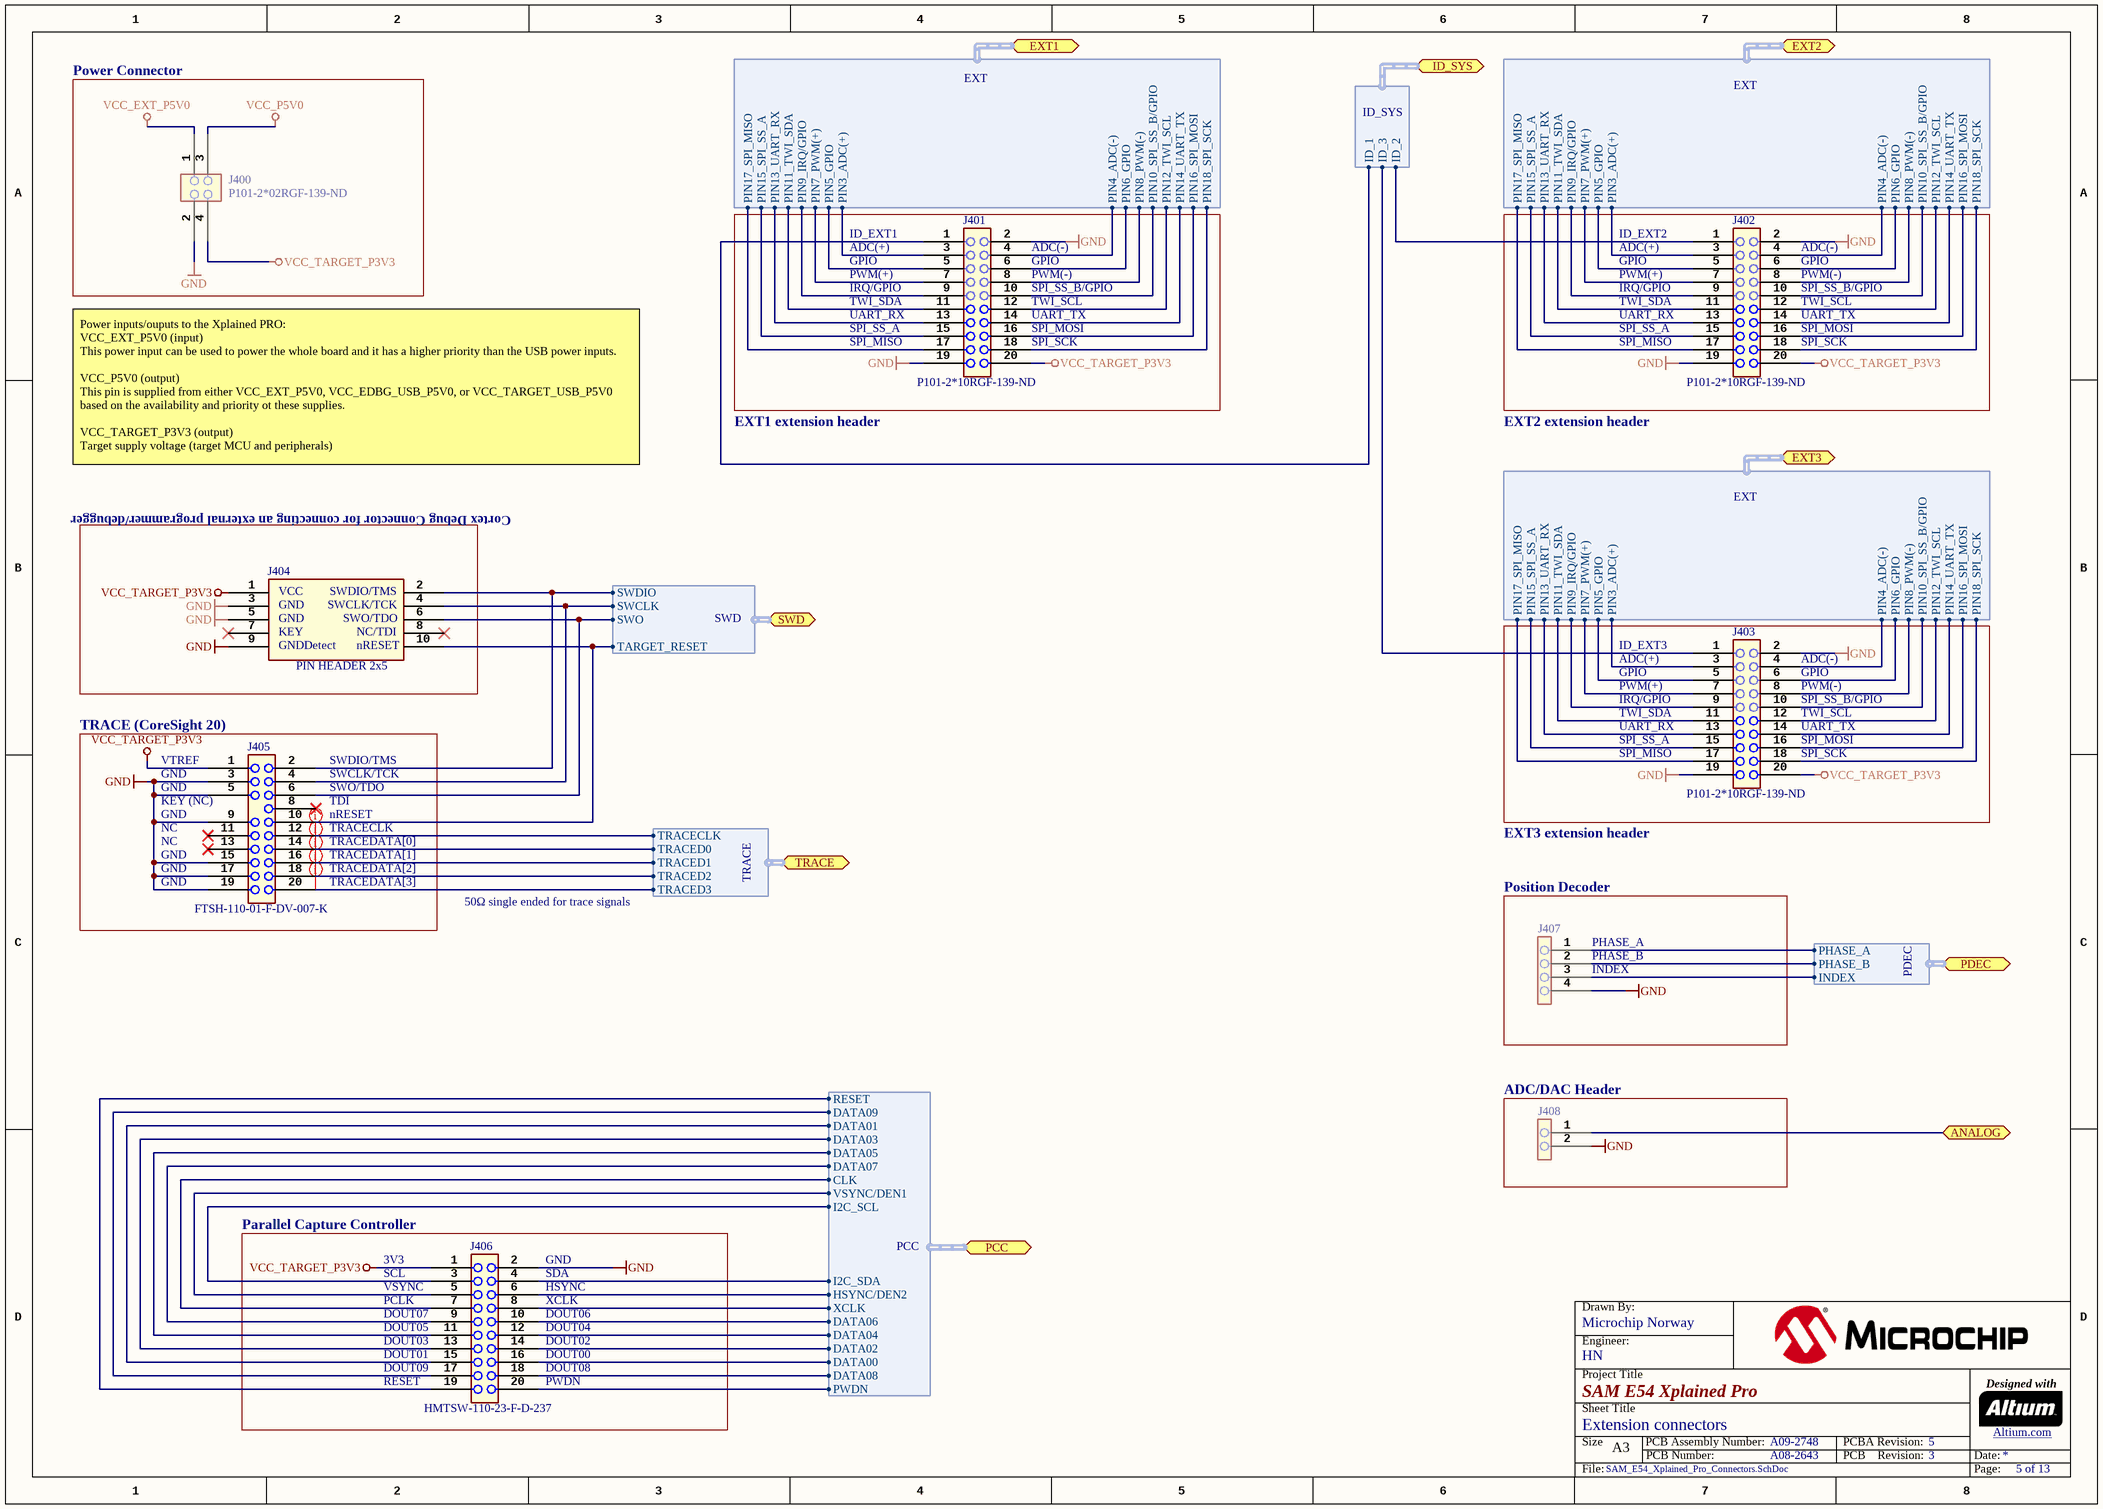
[diagram p3: SAM_E54_Xplained_Pro_Connectors.SchDoc]

### Parts
J400  value P101-2*02RGF-139-ND  [AP8-00628]
J401  value P101-2*10RGF-139-ND  [AP8-00622]
J402  value P101-2*10RGF-139-ND  [AP8-00622]
J403  value P101-2*10RGF-139-ND  [AP8-00622]
J404  value PIN HEADER 2x5  [AP8-00257]
J405  value FTSH-110-01-F-DV-007-K  [AP8-00910]
J406  value HMTSW-110-23-F-D-237  [AP8-00744]
J407  (no value)  [AP8-00176]
J408  (no value)  [AP8-00733]

### Blocks framed on the sheet
Power Connector: J400
TRACE (CoreSight 20): J405
Position Decoder: J407
ADC/DAC Header: J408
Parallel Capture Controller: J406

### Ports
ANALOG (bidir), EXT1 (harness EXT), EXT2 (harness EXT), EXT3 (harness EXT), ID_SYS (harness ID_SYS), PCC (harness PCC), PDEC (harness PDEC), SWD (harness SWD), TRACE (harness TRACE)

### Harnesses
ID_SYS: ID_1, ID_3, ID_2
EXT: PIN3_ADC(+), PIN4_ADC(-), PIN5_GPIO, PIN6_GPIO, PIN7_PWM(+), PIN8_PWM(-), PIN9_IRQ/GPIO, PIN10_SPI_SS_B/GPIO, PIN11_TWI_SDA, PIN12_TWI_SCL, PIN13_UART_RX, PIN14_UART_TX, PIN15_SPI_SS_A, PIN16_SPI_MOSI, PIN17_SPI_MISO, PIN18_SPI_SCK
TRACE: TRACECLK, TRACED0, TRACED1, TRACED2, TRACED3
SWD: SWCLK, SWDIO, TARGET_RESET, SWO
PCC: CLK, DATA00, DATA01, DATA02, DATA03, DATA04, DATA05, DATA06, DATA07, DATA08, DATA09, HSYNC/DEN2, I2C_SCL, I2C_SDA, PWDN, RESET, VSYNC/DEN1, XCLK
PDEC: PHASE_A, PHASE_B, INDEX

### Nets
GND: J400.2 J401.2 J401.19 J402.2 J402.19 J403.2 J403.19 J404.3 J404.5 J404.9 J405.3 J405.5 J405.9 J405.15 J405.17 J405.19 J406.2 J407.4 J408.2
VCC_EXT_P5V0: J400.1
VCC_P5V0: J400.3
VCC_TARGET_P3V3: J400.4 J401.20 J402.20 J403.20 J404.1 J405.1 J406.1
ID1: J401.1 ; port ID_SYS.ID_1
ID2: J402.1 ; port ID_SYS.ID_2
ID3: J403.1 ; port ID_SYS.ID_3
PA02_ADC0_AIN0_DAC0: J408.1 ; port ANALOG
PA03_ADC0_AIN1: J402.4 ; port EXT2.PIN4_ADC(-)
PA04_S0P0_UART_TX: J401.14 ; port EXT1.PIN14_UART_TX
PA05_S0P1_UART_RX: J401.13 ; port EXT1.PIN13_UART_RX
PA06_GPIO_S0P2_RTS: J401.5 ; port EXT1.PIN5_GPIO
PA07_GPIO_S0P3_CTS: J401.6 ; port EXT1.PIN6_GPIO
PA12_ETH_GRX1: J406.5 ; port PCC.VSYNC/DEN1
PA13_ETH_GRX0: J406.6 ; port PCC.HSYNC/DEN2
PA14_ETH_GTXCK: J406.7 ; port PCC.CLK
PA15_ETH_GRXER: J406.8 ; port PCC.XCLK
PA16_PCC_D00_PTCXY10: J406.16 ; port PCC.DATA00
PA17_ETH_GTXEN: J406.15 ; port PCC.DATA01
PA18_ETH_GTX0: J406.14 ; port PCC.DATA02
PA19_ETH_GTX1: J406.13 ; port PCC.DATA03
PA22_S3P0_I2C_SDA: J401.11 ; port EXT1.PIN11_TWI_SDA
PA23_S3P1_I2C_SCL: J401.12 ; port EXT1.PIN12_TWI_SCL
PA27_GPIO_SPI_SS_B: J401.10 ; port EXT1.PIN10_SPI_SS_B/GPIO
PA30_SWCLK: J404.4 J405.4 ; port SWD.SWCLK
PA31_SWDIO: J404.2 J405.2 ; port SWD.SWDIO
PB00_ADC0_AIN12: J402.3 ; port EXT2.PIN3_ADC(+)
PB01_GPIO: J402.5 ; port EXT2.PIN5_GPIO
PB02_GPIO_SPI_SS_B: J402.10 ; port EXT2.PIN10_SPI_SS_B/GPIO
PB04_ADC1_AIN6: J401.3 ; port EXT1.PIN3_ADC(+)
PB05_ADC1_AIN7: J401.4 ; port EXT1.PIN4_ADC(-)
PB06_GPIO: J402.6 ; port EXT2.PIN6_GPIO
PB07_GPIO_EXTINT7: J401.9 ; port EXT1.PIN9_IRQ/GPIO
PB08_TC4_WO0: J401.7 ; port EXT1.PIN7_PWM(+)
PB09_TC4_WO1: J401.8 ; port EXT1.PIN8_PWM(-)
PB14_TCC4_WO0: J402.7 J406.18 ; port EXT2.PIN7_PWM(+), port PCC.DATA08
PB15_TCC4_WO1: J402.8 J406.17 ; port EXT2.PIN8_PWM(-), port PCC.DATA09
PB16_S5P0_UART_TX: J402.14 ; port EXT2.PIN14_UART_TX
PB17_S5P1_UART_RX: J402.13 ; port EXT2.PIN13_UART_RX
PB26_S4P1_SPI_SCK: J401.18 ; port EXT1.PIN18_SPI_SCK
PB27_S4P0_SPI_MOSI: J401.16 ; port EXT1.PIN16_SPI_MOSI
PB28_S4P2_SPI_SS: J401.15 ; port EXT1.PIN15_SPI_SS_A
PB29_S4P3_SPI_MISO: J401.17 ; port EXT1.PIN17_SPI_MISO
PB30_SWO: J404.6 J405.6 ; port SWD.SWO
PC01_GPIO: J403.5 ; port EXT3.PIN5_GPIO
PC02_ADC1_AIN4: J403.3 ; port EXT3.PIN3_ADC(+)
PC03_ADC1_AIN5: J403.4 ; port EXT3.PIN4_ADC(-)
PC04_S6P0_SPI_MOSI: J402.16 J403.16 ; port EXT2.PIN16_SPI_MOSI, port EXT3.PIN16_SPI_MOSI
PC05_S6P1_SPI_SCK: J402.18 J403.18 ; port EXT2.PIN18_SPI_SCK, port EXT3.PIN18_SPI_SCK
PC06_S6P2_SPI_SS: J402.15 ; port EXT2.PIN15_SPI_SS_A
PC07_S6P3_SPI_MISO: J402.17 J403.17 ; port EXT2.PIN17_SPI_MISO, port EXT3.PIN17_SPI_MISO
PC10_GPIO: J403.6 ; port EXT3.PIN6_GPIO
PC11_ETH_GMDC: J406.20 ; port PCC.PWDN
PC12_ETH_GMDIO: J406.19 ; port PCC.RESET
PC14_EXT3_SPI_SS: J403.15 ; port EXT3.PIN15_SPI_SS_A
PC16_PDEC0_DGI0: J407.1 ; port PDEC.PHASE_A
PC17_PDEC1_DGI1: J407.2 ; port PDEC.PHASE_B
PC18_PDEC2_DGI2_LED: J407.3 ; port PDEC.INDEX
PC22_S1P0_UART_TX: J403.14 ; port EXT3.PIN14_UART_TX
PC23_S1P1_UART_RX: J403.13 ; port EXT3.PIN13_UART_RX
PC24_TRACE_DATA3: J405.20 ; port TRACE.TRACED3
PC25_TRACE_DATA2: J405.18 ; port TRACE.TRACED2
PC26_TRACE_DATA1: J405.16 ; port TRACE.TRACED1
PC27_TRACE_CLK: J405.12 ; port TRACE.TRACECLK
PC28_TRACE_DATA0: J405.14 ; port TRACE.TRACED0
PC30_GPIO_EXTINT14: J403.9 ; port EXT3.PIN9_IRQ/GPIO
PC31_GPIO_SPI_SS_B: J403.10 ; port EXT3.PIN10_SPI_SS_B/GPIO
PD00_GPIO_EXTINT0: J402.9 ; port EXT2.PIN9_IRQ/GPIO
PD08_S7P0_I2C_SDA: J402.11 J403.11 J406.4 ; port EXT2.PIN11_TWI_SDA, port EXT3.PIN11_TWI_SDA, port PCC.I2C_SDA
PD09_S7P1_I2C_SCL: J402.12 J403.12 J406.3 ; port EXT2.PIN12_TWI_SCL, port EXT3.PIN12_TWI_SCL, port PCC.I2C_SCL
PD10_TCC0_WO3: J403.7 ; port EXT3.PIN7_PWM(+)
PD11_TCC0_WO4: J403.8 ; port EXT3.PIN8_PWM(-)
TARGET_RESETN: J404.10 J405.10 ; port SWD.TARGET_RESET
NetJ406_9: J406.9 ; port PCC.DATA07
NetJ406_10: J406.10 ; port PCC.DATA06
NetJ406_11: J406.11 ; port PCC.DATA05
NetJ406_12: J406.12 ; port PCC.DATA04

Not connected (* = marked no-connect by the designer): J404 7* 8*; J405 8* 11* 13*

### Layout directives
net class TRACE: PC24_TRACE_DATA3, PC25_TRACE_DATA2, PC26_TRACE_DATA1, PC27_TRACE_CLK, PC28_TRACE_DATA0

### Notes on the sheet
- ID_EXT1
- ID_EXT2
- ADC(+)
- GPIO
- PWM(+)
- IRQ/GPIO
- TWI_SDA
- UART_RX
- (near J401) ADC(-)
- (near J401) GPIO
- (near J401) PWM(-)
- (near J401) SPI_SS_B/GPIO
- (near J401) TWI_SCL
- (near J401) UART_TX
- (near J402) ADC(-)
- (near J402) GPIO
- (near J402) PWM(-)
- (near J402) SPI_SS_B/GPIO
- (near J402) TWI_SCL
- (near J402) UART_TX
- SPI_SS_A
- SPI_MISO
- (near J401) SPI_MOSI
- (near J401) SPI_SCK
- (near J402) SPI_MOSI
- (near J402) SPI_SCK
- EXT1 extension header
- EXT2 extension header
- Power inputs/ouputs to the Xplained PRO:
  VCC_EXT_P5V0 (input)
  This power input can be used to power the whole board and it has a higher priority than the USB power inputs.
  VCC_P5V0 (output)
  This pin is supplied from either VCC_EXT_P5V0, VCC_EDBG_USB_P5V0, or VCC_TARGET_USB_P5V0 based on the availability and priority ot these supplies.
  VCC_TARGET_P3V3 (output)
  Target supply voltage (target MCU and peripherals)
- Cortex Debug Connector for connecting an external programmer/debugger
- ID_EXT3
- (near J403) ADC(-)
- (near J403) GPIO
- (near J403) PWM(-)
- (near J403) SPI_SS_B/GPIO
- (near J403) TWI_SCL
- VTREF
- GND
- SWDIO/TMS
- SWCLK/TCK
- (near J403) UART_TX
- (near J403) SPI_MOSI
- (near J403) SPI_SCK
- (near J405) KEY (NC)
- NC
- TRACEDATA[1]
- TDI
- SWO/TDO
- nRESET
- TRACEDATA[0]
- TRACECLK
- EXT3 extension header
- TRACEDATA[2]
- TRACEDATA[3]
- 50Ω single ended for trace signals
- (near J407) PHASE_A
- (near J407) PHASE_B
- (near J407) INDEX
- 3V3
- (near J406) GND
- SCL
- VSYNC
- PCLK
- (near J406) DOUT07
- (near J406) HSYNC
- (near J406) SDA
- (near J406) XCLK
- (near J406) DOUT06
- (near J406) DOUT01
- (near J406) DOUT03
- (near J406) DOUT05
- (near J406) DOUT09
- RESET
- (near J406) DOUT00
- (near J406) DOUT02
- (near J406) DOUT04
- (near J406) DOUT08
- (near J406) PWDN
- Drawn By:
- Project Title
- Engineer:
- Designed with
- Sheet Title
- Size
- A3
- PCB Number:
- PCB Assembly Number:
- PCBA Revision:
- PCB    Revision:
- Date:
- Altium.com <http://go.altium.com/MicrochipLandingPage_Evaluation.html>
- File:
- Page:
- (in symbol A08-0385) VCC; SWDIO/TMS; GND; SWCLK/TCK; SWO/TDO; KEY; NC/TDI; GNDDetect; nRESET

### Library data of the parts
J400 = A08-1519: Pin header, 2x2, Right Angle, 2.54mm, THT, Pin In Paste; PartGroup: Mechanical devices,Connectors,Pin headers; Manufacturer: Pro-data International Corp; AN: A08-1519; Height: 5,07999992370605; MPN: P101-2*02RGF-139-ND
J401-J403 = A08-1513: Pin header, 2x10, Right Angle, 2.54mm, THM, Pin In Paste; PartGroup: Mechanical devices,Connectors,Pin headers; Manufacturer: Pro-data International Corp; AN: A08-1513; MPN: P101-2*10RGF-139-ND
J404 = A08-0385: 2x5 pin header, 1.27mm pitch, THM; PartGroup: Mechanical devices,Connectors,Pin headers; Manufacturer: Garry; MPN: 176-2-010-0-T-XS0-0730; AN: A08-0385; Height: 7,30000019073486
J405 = A08-2290: SAMTEC FTSH series 50-mil header, shrouded, pin 7 removed, SMD; PartGroup: Mechanical devices,Connectors,Pin headers; TemperatureRange: -55Â°C to +125Â°C; AN: A08-2290; Height: 6,1100001335144; Manufacturer: SAMTEC; MPN: FTSH-110-01-F-DV-007-K
J406 = A08-1801: 2x10 pin header, 2.54mm pitch, Pin-in-Paste THM, 1mm hole; PartGroup: Mechanical devices,Connectors,Pin headers; Manufacturer: SAMTEC; AN: A08-1801; MPN: HMTSW-110-23-F-D-237; Height: 6,09999990463257
J407 = A08-1653: 1x4 pin header, 2.54mm pitch, Pin-in-Paste THM; PartGroup: Mechanical devices,Connectors,Pin headers; Manufacturer: SAMTEC; Value: HMTSW-104-23-F-S-237; TemperatureRange: - 55 ï¿½C to + 125 ï¿½C; AN: A08-1653; Height: 6,09999990463257; MPN: HMTSW-104-23-F-S-237
J408 = A08-1754: 1x2 pin header, 2.54mm pitch, Pin-in-Paste THM; PartGroup: Mechanical devices,Connectors,Pin headers; Manufacturer: SAMTEC; Value: HMTSW-102-23-F-S-237; TemperatureRange: - 55 deg C to + 125 deg C; AN: A08-1754; Height: 6,09999990463257; MPN: HMTSW-102-23-F-S-237